# Altium project MAX96724_EVB_revB.PrjPcb
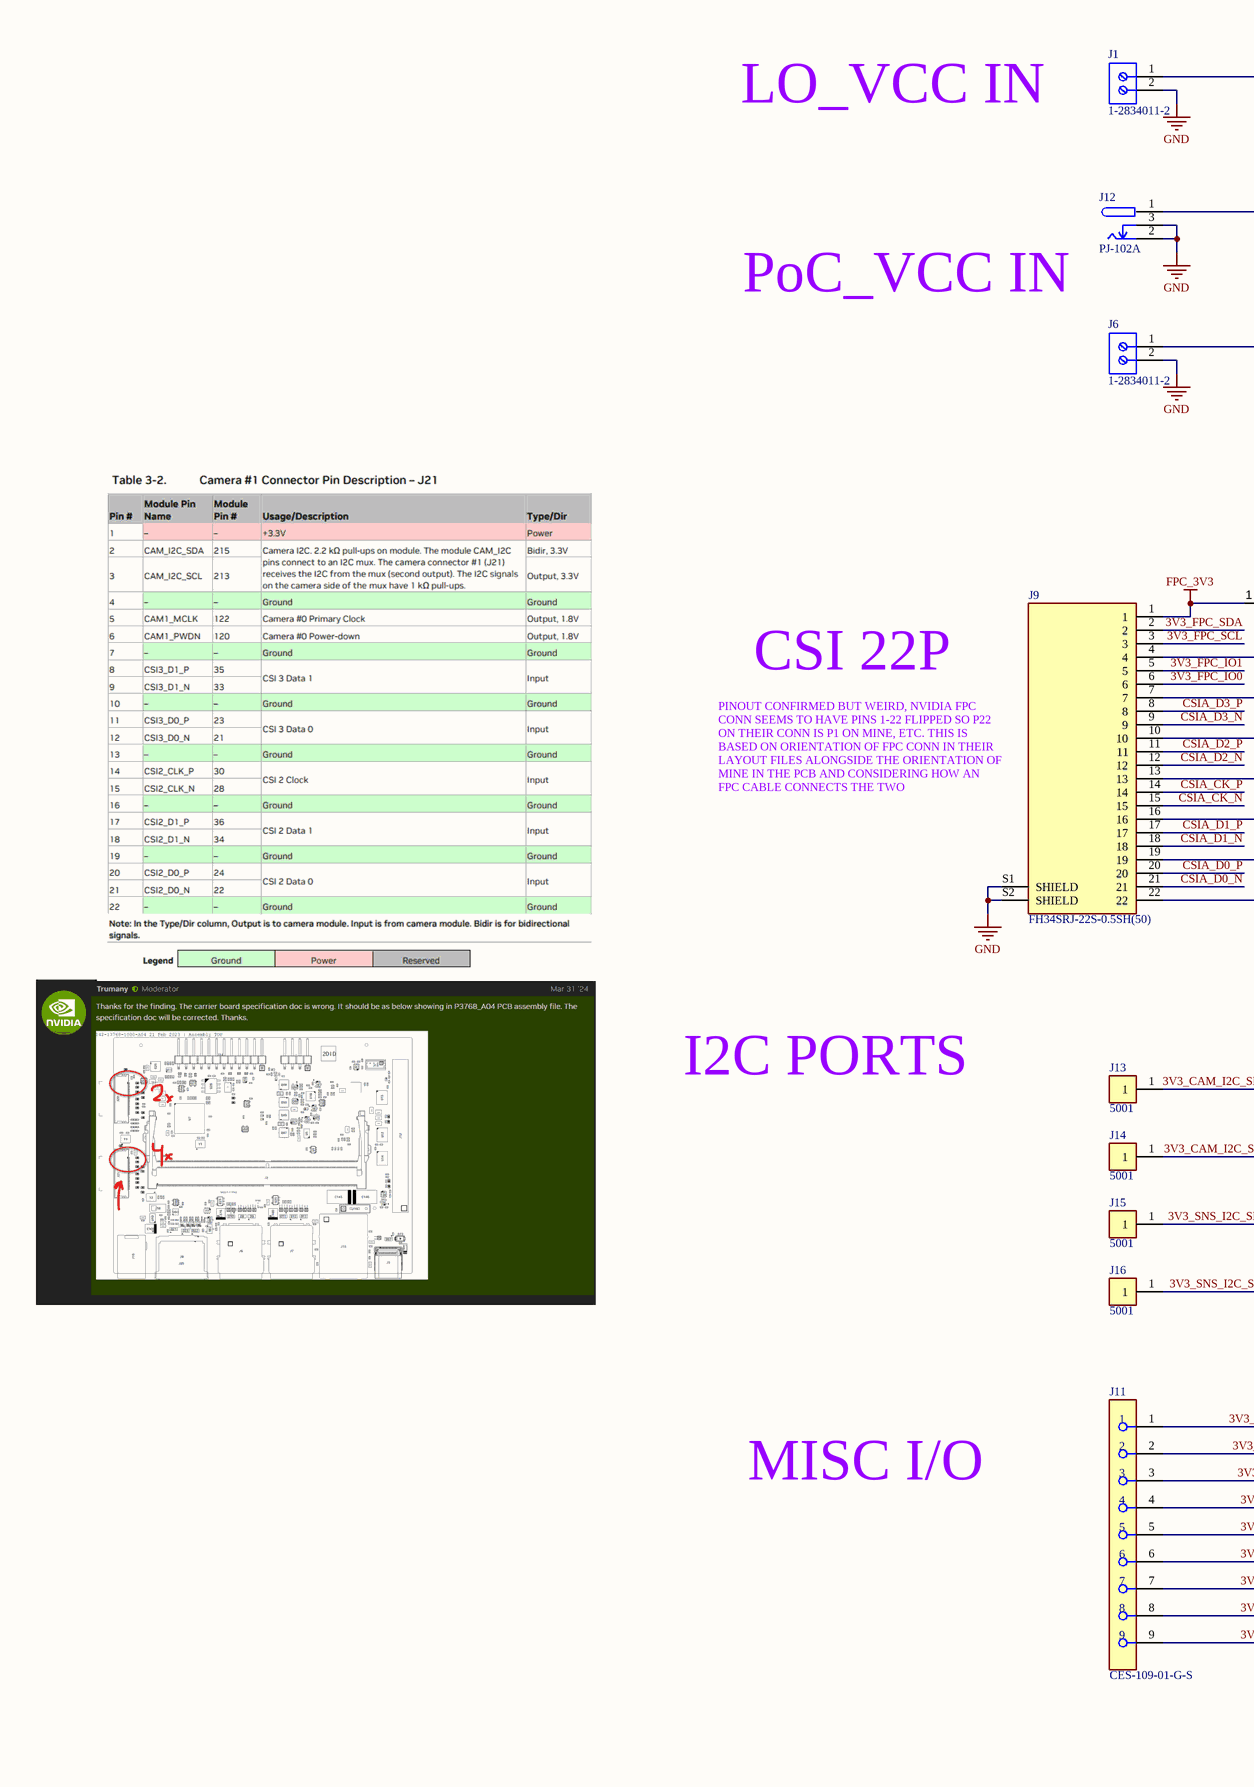
[diagram p0: MAX96724_EVB_revB.SchDoc, left]
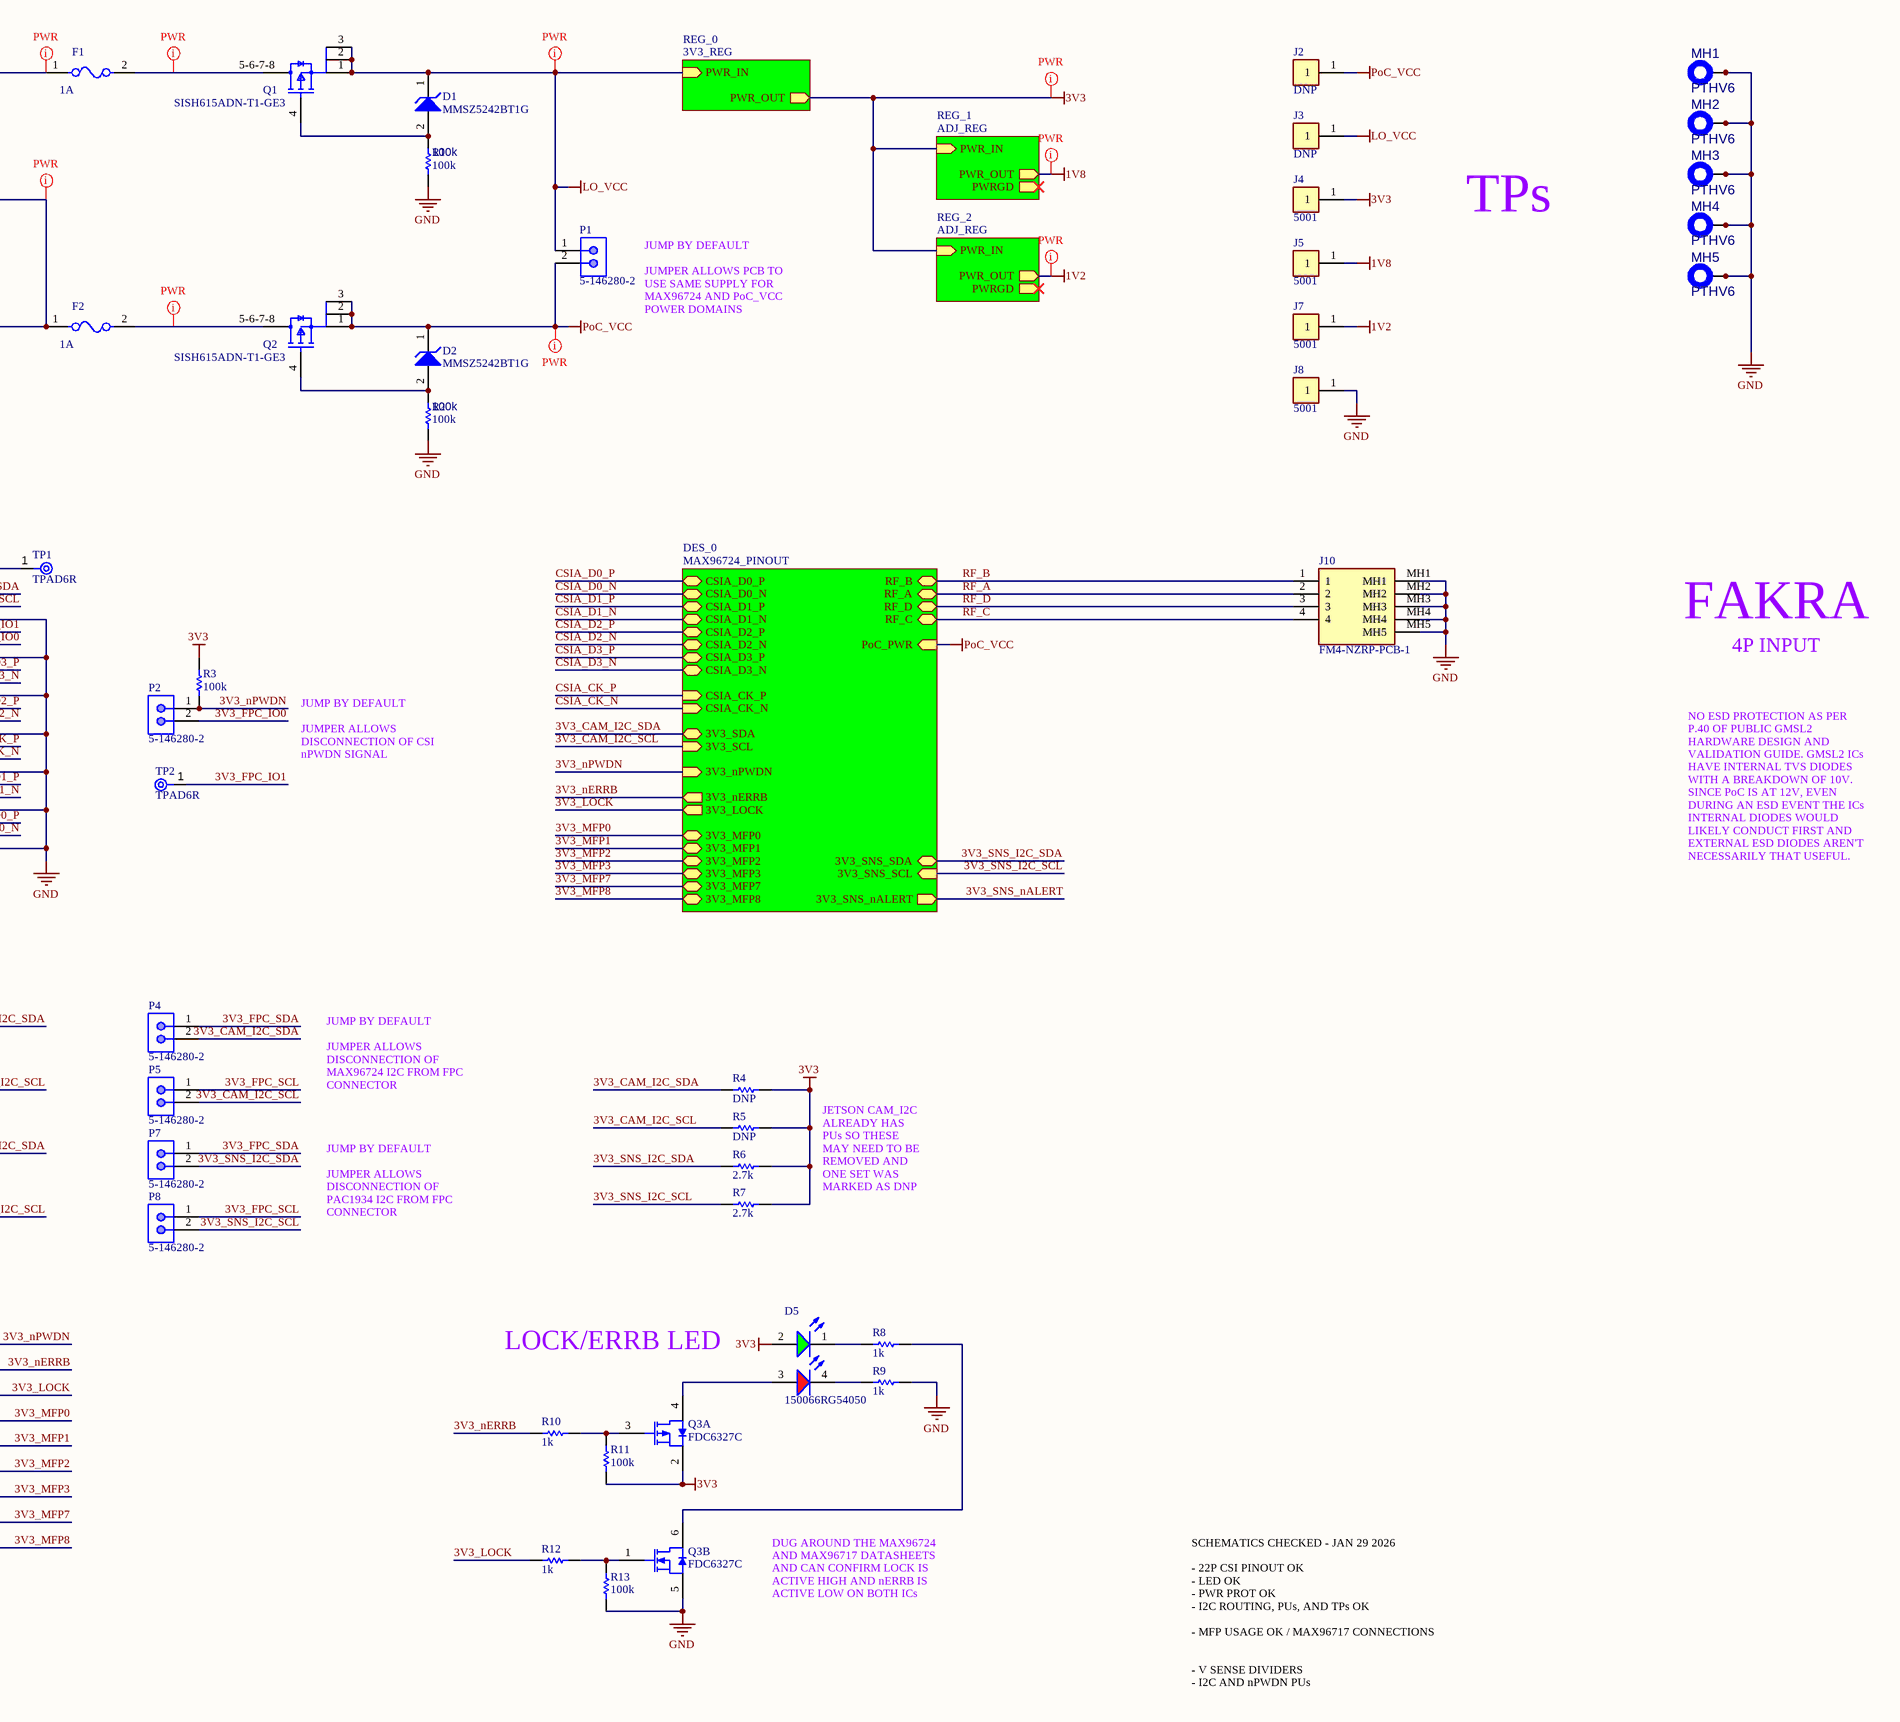
[diagram p1: MAX96724_EVB_revB.SchDoc, right]
4 sheets, 167 parts. Net scope: hierarchical (ports join the sheet entries above them; power ports are global).
Board file: MAX96724_EVB_revB.PcbDoc
Sheets:
  MAX96724_EVB_revB.SchDoc
    DES_0 = MAX96724_PINOUT.SchDoc
    REG_0 = 3V3_REG.SchDoc
    REG_1 = ADJ_REG.SchDoc
    REG_2 = ADJ_REG.SchDoc

## Sheet MAX96724_EVB_revB.SchDoc
size C; SheetNumber: 1; SheetTotal: 4

### Parts
D1  MMSZ5242BT1G  [ONSC-SOD-123-2-425-04_V]
D2  MMSZ5242BT1G  [ONSC-SOD-123-2-425-04_V]
D5  150066RG54050  [WL-SBCD_0606]
F1  1A  [FP-SF-1206FP-MFG]
F2  1A  [FP-SF-1206FP-MFG]
J1  1-2834011-2  [1-2834011-2-Footprint-1]
J2  DNP  [FP-5001-MFG]
J3  DNP  [FP-5001-MFG]
J4  5001  [FP-5001-MFG]
J5  5001  [FP-5001-MFG]
J6  1-2834011-2  [1-2834011-2-Footprint-1]
J7  5001  [FP-5001-MFG]
J8  5001  [FP-5001-MFG]
J9  FH34SRJ-22S-0.5SH(50)  [FH34SRJ-22S-0.5SH(50)-Footprint-1]
J10  FM4-NZRP-PCB-1  [FM4-NZRP-PCB-1-Footprint-1]
J11  CES-109-01-G-S  [FP-CES-109-01-G-S-MFG]
J12  PJ-102A  [FP-PJ-102A-MFG]
J13  5001  [FP-5001-MFG]
J14  5001  [FP-5001-MFG]
J15  5001  [FP-5001-MFG]
J16  5001  [FP-5001-MFG]
MH1  PTHV6  [PTHV6 M2]  (net tie, no BOM)
MH2  PTHV6  [PTHV6 M2]  (net tie, no BOM)
MH3  PTHV6  [PTHV6 M2]  (net tie, no BOM)
MH4  PTHV6  [PTHV6 M2]  (net tie, no BOM)
MH5  PTHV6  [PTHV6 M2]  (net tie, no BOM)
P1  5-146280-2  [TECO-5-146280-2_V]
P2  5-146280-2  [TECO-5-146280-2_V]
P4  5-146280-2  [TECO-5-146280-2_V]
P5  5-146280-2  [TECO-5-146280-2_V]
P7  5-146280-2  [TECO-5-146280-2_V]
P8  5-146280-2  [TECO-5-146280-2_V]
Q1  SISH615ADN-T1-GE3  [SISH615ADN-T1-GE3-Footprint-1]
Q2  SISH615ADN-T1-GE3  [SISH615ADN-T1-GE3-Footprint-1]
Q3  FDC6327C  [FAIR-SOT23-6_V]  (parts A,B of 2)
R1  100k  [R0603B]
R2  100k  [R0603B]
R3  100k  [R0603B]
R4  DNP  [R0603B]
R5  DNP  [R0603B]
R6  2.7k  [R0603B]
R7  2.7k  [R0603B]
R8  1k  [R0603B]
R9  1k  [R0603B]
R10  1k  [R0603B]
R11  100k  [R0603B]
R12  1k  [R0603B]
R13  100k  [R0603B]
TP1  TPAD6R  [New footprint 1]  (no BOM)
TP2  TPAD6R  [New footprint 1]  (no BOM)

### Sub-sheets
DES_0 = MAX96724_PINOUT: PoC_PWR (in), RF_B (bidir), RF_A (bidir), RF_C (bidir), RF_D (bidir), 3V3_SDA (bidir), 3V3_SCL (in), 3V3_nPWDN (in), 3V3_nERRB (out), 3V3_LOCK (out), 3V3_MFP0 (bidir), 3V3_MFP1 (bidir), 3V3_MFP2 (bidir), 3V3_MFP3 (bidir), 3V3_MFP7 (bidir), 3V3_MFP8 (bidir), 3V3_SNS_SDA (bidir), 3V3_SNS_SCL (in), 3V3_SNS_nALERT (out), CSIA_D0_P (bidir), CSIA_D0_N (bidir), CSIA_D1_P (bidir), CSIA_D1_N (bidir), CSIA_D2_P (bidir), CSIA_D2_N (bidir), CSIA_D3_P (bidir), CSIA_D3_N (bidir), CSIA_CK_P (in), CSIA_CK_N (in)
REG_0 = 3V3_REG: PWR_IN (in), PWR_OUT (out)
REG_1 = ADJ_REG: PWR_OUT (out), PWR_IN (in), PWRGD (out)
REG_2 = ADJ_REG: PWR_OUT (out), PWR_IN (in), PWRGD (out)

### Nets
1V2: J7.1 ; sheet REG_2/PWR_OUT
1V8: J5.1 ; sheet REG_1/PWR_OUT
3V3: D5.2(A) J4.1 Q3.2(S) R3.2 R4.2 R5.2 R6.2 R7.2 R11.1 ; sheet REG_0/PWR_OUT, sheet REG_1/PWR_IN, sheet REG_2/PWR_IN
FPC_3V3: J9.1 TP1.1(TP)
GND: J1.2 J6.2 J8.1 J9.4 J9.7 J9.10 J9.13 J9.16 J9.19 J9.22 J9.S1(SHIELD) J9.S2(SHIELD) J10.MH1 J10.MH2 J10.MH3 J10.MH4 J10.MH5 J12.2 J12.3 MH1.1(MH) MH1.2(V1) MH1.3(V2) MH1.4(V3) MH1.5(V4) MH1.6(V5) MH1.7(V6) MH2.1(MH) MH2.2(V1) MH2.3(V2) MH2.4(V3) MH2.5(V4) MH2.6(V5) MH2.7(V6) MH3.1(MH) MH3.2(V1) MH3.3(V2) MH3.4(V3) MH3.5(V4) MH3.6(V5) MH3.7(V6) MH4.1(MH) MH4.2(V1) MH4.3(V2) MH4.4(V3) MH4.5(V4) MH4.6(V5) MH4.7(V6) MH5.1(MH) MH5.2(V1) MH5.3(V2) MH5.4(V3) MH5.5(V4) MH5.6(V5) MH5.7(V6) Q3.5(S) R1.1 R2.1 R9.1 R13.2
LO_VCC: D1.1(K) J3.1 P1.1 Q1.1(S) Q1.2(S) Q1.3(S) ; sheet REG_0/PWR_IN
PoC_VCC: D2.1(K) J2.1 P1.2 Q2.1(S) Q2.2(S) Q2.3(S) ; sheet DES_0/PoC_PWR
3V3_CAM_I2C_SCL: J14.1 P5.2 R5.1 ; sheet DES_0/3V3_SCL
3V3_CAM_I2C_SDA: J13.1 P4.2 R4.1 ; sheet DES_0/3V3_SDA
3V3_FPC_IO0: J9.6 P2.2
3V3_FPC_IO1: J9.5 TP2.1(TP)
3V3_FPC_SCL: J9.3 P5.1 P8.1
3V3_FPC_SDA: J9.2 P4.1 P7.1
3V3_LOCK: J11.3 R12.2 ; sheet DES_0/3V3_LOCK
3V3_MFP0: J11.4 ; sheet DES_0/3V3_MFP0
3V3_MFP1: J11.5 ; sheet DES_0/3V3_MFP1
3V3_MFP2: J11.6 ; sheet DES_0/3V3_MFP2
3V3_MFP3: J11.7 ; sheet DES_0/3V3_MFP3
3V3_MFP7: J11.8 ; sheet DES_0/3V3_MFP7
3V3_MFP8: J11.9 ; sheet DES_0/3V3_MFP8
3V3_nERRB: J11.2 R10.1 ; sheet DES_0/3V3_nERRB
3V3_nPWDN: J11.1 P2.1 R3.1 ; sheet DES_0/3V3_nPWDN
3V3_SNS_I2C_SCL: J16.1 P8.2 R7.1 ; sheet DES_0/3V3_SNS_SCL
3V3_SNS_I2C_SDA: J15.1 P7.2 R6.1 ; sheet DES_0/3V3_SNS_SDA
CSIA_CK_N: J9.15 ; sheet DES_0/CSIA_CK_N
CSIA_CK_P: J9.14 ; sheet DES_0/CSIA_CK_P
CSIA_D0_N: J9.21 ; sheet DES_0/CSIA_D0_N
CSIA_D0_P: J9.20 ; sheet DES_0/CSIA_D0_P
CSIA_D1_N: J9.18 ; sheet DES_0/CSIA_D1_N
CSIA_D1_P: J9.17 ; sheet DES_0/CSIA_D1_P
CSIA_D2_N: J9.12 ; sheet DES_0/CSIA_D2_N
CSIA_D2_P: J9.11 ; sheet DES_0/CSIA_D2_P
CSIA_D3_N: J9.9 ; sheet DES_0/CSIA_D3_N
CSIA_D3_P: J9.8 ; sheet DES_0/CSIA_D3_P
RF_A: J10.2 ; sheet DES_0/RF_A
RF_B: J10.1 ; sheet DES_0/RF_B
RF_C: J10.4 ; sheet DES_0/RF_C
RF_D: J10.3 ; sheet DES_0/RF_D
NetD1_2: D1.2(A) Q1.4(G) R1.2
NetD2_2: D2.2(A) Q2.4(G) R2.2
NetD5_1: D5.1(K) R8.2
NetD5_3: D5.3(A) Q3.4(D)
NetD5_4: D5.4(K) R9.2
NetF1_1: F1.1 J1.1
NetF1_2: F1.2 Q1.5-6-7-8(D)
NetF2_1: F2.1 J6.1 J12.1
NetF2_2: F2.2 Q2.5-6-7-8(D)
NetQ3_1: Q3.1(G) R12.1 R13.1
NetQ3_3: Q3.3(G) R10.2 R11.2
NetQ3_6: Q3.6(D) R8.1

### Layout directives
net class PWR: 1V2, 1V8, 3V3, LO_VCC, NetF1_1, NetF1_2, NetF2_1, NetF2_2, PoC_VCC

### Notes on the sheet
- LO_VCC IN
- TPs
- PoC_VCC IN
- JUMP BY DEFAULT
  JUMPER ALLOWS PCB TO USE SAME SUPPLY FOR MAX96724 AND PoC_VCC POWER DOMAINS
- CSI 22P
- FAKRA
- 4P INPUT
- (near J9) PINOUT CONFIRMED BUT WEIRD, NVIDIA FPC CONN SEEMS TO HAVE PINS 1-22 FLIPPED SO P22 ON THEIR CONN IS P1 ON MINE, ETC. THIS IS BASED ON ORIENTATION OF FPC CONN IN THEIR LAYOUT FILES ALONGSIDE THE ORIENTATION OF MINE IN THE PCB AND CONSIDERING HOW AN FPC CABLE CONNECTS THE TWO
- JUMP BY DEFAULT
  JUMPER ALLOWS DISCONNECTION OF CSI nPWDN SIGNAL
- NO ESD PROTECTION AS PER P.40 OF PUBLIC GMSL2 HARDWARE DESIGN AND VALIDATION GUIDE. GMSL2 ICs HAVE INTERNAL TVS DIODES WITH A BREAKDOWN OF 10V. SINCE PoC IS AT 12V, EVEN DURING AN ESD EVENT THE ICs INTERNAL DIODES WOULD LIKELY CONDUCT FIRST AND EXTERNAL ESD DIODES AREN'T NECESSARILY THAT USEFUL.
- I2C PORTS
- JUMP BY DEFAULT
  JUMPER ALLOWS DISCONNECTION OF MAX96724 I2C FROM FPC CONNECTOR
- JUMP BY DEFAULT
  JUMPER ALLOWS DISCONNECTION OF PAC1934 I2C FROM FPC CONNECTOR
- JETSON CAM_I2C ALREADY HAS PUs SO THESE MAY NEED TO BE REMOVED AND ONE SET WAS MARKED AS DNP
- LOCK/ERRB LED
- MISC I/O
- DUG AROUND THE MAX96724 AND MAX96717 DATASHEETS AND CAN CONFIRM LOCK IS ACTIVE HIGH AND nERRB IS ACTIVE LOW ON BOTH ICs
- SCHEMATICS CHECKED - JAN 29 2026
  - 22P CSI PINOUT OK
  - LED OK
  - PWR PROT OK
  - I2C ROUTING, PUs, AND TPs OK
  - MFP USAGE OK / MAX96717 CONNECTIONS
  - V SENSE DIVIDERS
  - I2C AND nPWDN PUs

### Library data of the parts
D1 D2 = CMP-1060-00565-1: Zener Voltage Regulator, 500 mW, 2-Pin SOD-123, Pb-Free, Tape and Reel; Manufacturer: On Semiconductor; P Max (W): 0.5; VZ Typ (V): 12; PartNumber: MMSZ5242BT1G; PackageReference: SOD-123-2-425-04; ComponentLink3URL: http://www.onsemi.com/pub_link/Collateral/425-04.PDF; Mounting Technology: Surface Mount; ComponentLink2Description: Datasheet; ComponentLink1URL: http://www.onsemi.com/; ComponentLink3Description: Package Specification; PackageDescription: 2-Pin SOD, Body 1.6 x 2.69 mm; PackageVersion: Rev. G, 10/2009; ComponentLink1Description: Manufacturer URL; RoHS: Pb-Free; ComponentLink2URL: http://www.onsemi.com/pub_link/Collateral/MMSZ5221BT1-D.PDF; Packing: Tape and Reel; DatasheetVersion: Rev. 12
D5 = CMP-004-00040-2: Led, Red/Grn, 180Mcd/230Mcd, 624Nm/525Nm Rohs Compliant: Yes; Source: rgled.SchLib; Component Type: Standard; Design Item ID: CMP-004-00034-2; Pins: 4
F1 F2 = CMP-07399-000013-1: FUSE BOARD MOUNT 2A 63VDC 1206; Voltage Rating (DC): 63V; Fuse Type: Board Mount (Cartridge Style Excluded); Approvals: UL; Mount: Surface Mount; Min Operating Temperature: -20°C; Max Operating Temperature: 105°C; Case Code (Imperial): 1206; Packaging: Cut Tape; Current Rating: 2A; RoHS Compliant: Yes; Series: SinglFuse™ SF-1206FP; Case Code (Metric): 3216; Case/Package: 1206
J1 J6 = CMP-002-00067-1: Barrier Strip Terminal Block; RoHS Compliant: Yes
J2-J5 J7 J8 J13-J16 = CMP-2000-05181-2: PC TEST POINT MINIATURE BLACK; Body Material: Bronze; Plating: Silver; Inside Diameter: 1.27mm; Hole Diameter: 1.6mm; Number of Ports: 1; Outside Diameter: 2.54mm; Insulation: Insulated; Insulation Material: Nylon; Mount: Through Hole; RoHS Compliant: Yes; Series: THM; Height: 0.3inch; Termination: Through Hole; Material: Nylon; Packaging: Bulk; Contact Material: Bronze; REACH SVHC: No SVHC; Contact Plating: Silver; Orientation: Straight; Lead Free: Lead Free; Package Quantity: 100; Length: 7.62mm; Flammability Rating: UL94 V-0; Number of Contacts: 1; Diameter: 2.54mm; Housing Color: Black; Color: Black
J9 = CMP-002-00104-1: 0.5Mm Pitch, 1.0Mm Height, Top And Bottom Contact, Back-Flip; Connector Type: Receptacle; Pins: 22; Min Operating Temperature: -55°C; Max Operating Temperature: 105°C; Mounting Technology: Surface Mount
J10 = CMP-002-00044-4: Connector RF Mini-FAKRA Plug 9GHz 50Ohm Solder Right Angle Through Hole; Source: fakra4ch.SchLib; Component Type: Standard; Pins: 9; Design Item ID: CMP-002-00085-1
J11 = CMP-00575-09340057-1: CES-109-01-G-S Conn Socket Strip SKT 9 POS 2.54mm Solder ST Top Entry Thru-Hole Tube; Manufacturer Lifecycle Status: PRODUCTION; Current Rating: 5.5A; Max Current Rating: 1A; Number of Contacts: 9; Max Voltage Rating (AC): 333V; Voltage Rating: 400V; Gender: Receptacle; Contact Resistance: 10mΩ; Depth: 3.05mm; NexarPartId: 9340057; Contact Plating: Gold; Termination: Solder; Housing Color: Black; REACH SVHC: No SVHC; Contact Material: Bronze, Gold, Nickel; Min Operating Temperature: -55°C; Radiation Hardening: No; Orientation: Straight; Length: 22.86mm; RoHS: Compliant; Housing Material: Polyester; Lifecycle Status: Production; Max Operating Temperature: 125°C; Pitch: 2.54mm; Height: 5.21mm; Number of Rows: 1
J12 = CMP-12637-106234071-1: PJ-102A 2.0 x 6.5 mm, 2.5 A, Horizontal, Through Hole, Tapered Pins, Dc Power Jack Connector; Voltage Rating (DC): 24V; Number of Contacts: 3; Outside Diameter: 6.5mm; Gender: Male; Shielding: No; Insulation Resistance: 50MΩ; Current Rating: 2.5A; Inside Diameter: 2mm; Number of Conductors: 2; Housing Color: Black; RoHS: Compliant; Diameter: 2.1mm; Mount: Through Hole; Contact Plating: Nickel; NexarPartId: 106234071; Voltage Rating: 24V; Housing Material: Thermoplastic; Max Operating Temperature: 85°C; Color: Black; Contact Material: Copper, Nickel, Tin; Orientation: Horizontal; Packaging: Bulk; Flammability Rating: UL94 V-0; Schedule B: 8536695050, 8536695050; Contact Gender: Male; Lead Free: Lead Free; Termination: Through Hole; Min Operating Temperature: -25°C; Height: 11.2mm; Lifecycle Status: Production
MH1-MH5 = CMP-00028-00001-13: Plated mounting hole with 6 peripheral vias. This is a generic symbol that groups all relevant footprints.
P1 P2 P4 P5 P7 P8 = CMP-2000-07492-1: Male Header, Pitch 2.54 mm, 1 x 2 Position, Height 8.21 mm, Tail Length 3.05 mm, -65 to 105 degC, RoHS, Bulk; Manufacturer: TE Connectivity; Mating Connector Lock: No(Without); Number of Positions: 2; Pitch: 2.54mm; PCB Mounting Orientation: Vertical; Keyed: No; Case\/Package: 100; Mating Post Length: 0.23inch; High Temperature Housing: Yes; Max Current Rating: 5A; PCB Thickness: 0.063inch; PCB Mount Retention: Without; Approvals: CSA; Current Rating: 3A; Radiation Hardening: No; Length: 4.67mm; Contact Mating Length: 0.23inch; Connector Type: Header; Number of Rows: 1; Termination Post Length: 0.12inch; Board Standoff: No(Without); Max Operating Temperature: 105degC; Contact Shape: Square; Selectively Loaded: No(Without); Gasket: No(Without); Number of Contacts: 2; Contact Gender: Male; Mating Alignment: No(Without); Manufacturer URL: http://www.te.com/; Datasheet URL: http://www.te.com/commerce/DocumentDelivery/DDEController?Action=showdoc&DocId=Customer+Drawing%7F146280%7FH1%7Fpdf%7FEnglish%7FENG_CD_146280_H1.pdf%7F5-146280-2; Mount: ThroughHole; Orientation: Straight; Packaging: Carton; Package Reference: 5-146280-2; Package Quantity: 500; Stabilizers: No(Without); Row Spacing: 2.54mm; Contact Material: CopperAlloy; Panel Mount Retention: No(Without); Datasheet Version: Rev. H1, 08/2016; Housing Colour: Black; Colour: Black; Package Description: Male Header, Pitch 2.54 mm, 1 x 2 Position, Height 8.21 mm, Tail Length 3.05 mm; Contact Plating: Matte; Housing Material: Polymer; Contact Protection: No(Without); Min Operating Temperature: -65degC; Mounting Technology: ThroughHole; Flammability Rating: UL94V-0; RoHSCompliant: true; Termination: ThroughHole; Depth: 2.34mm; High Speed Serial Data Connector: No
Q1 Q2 = CMP-013-00018-2: Trans MOSFET P-CH 20V 22.1A 8-Pin PowerPAK 1212 EP T/R; Source: SISH615ADN-T1-GE3.SchLib; Design Item ID: CMP-013-00036-4; Component Type: Standard; Pins: 5
Q3 = CMP-2000-04939-1: Dual N & P-Channel 2.5 V Specified PowerTrench(TM) MOSFET, -55 to 150 degC, 6-Pin SOT-23, RoHS, Tape and Reel; Manufacturer: Fairchild; Typical Rise Time: 9@NChannel; Rad Hard: No; Maximum Drain Source Voltage: 20V; Typical Fall Time: 3@NChannel; Typical Turn-On Delay Time: 5@NChannel; Maximum Continuous Drain Current: 2.7@NChannel; Typical Turn-Off Delay Time: 12@NChannel; RDS-on: 80@4.5V@NChannel; Channel Mode: Enhancement; Maximum Gate Source Voltage: ±8V; Package Version: Rev. 5, 05/2015; Operating Temperature: -55to150degC; Packaging: Tape&Reel; Package Reference: SOT23-6; Package URL: https://www.fairchildsemi.com/package-drawings/MA/MA06A.pdf; Package Description: 6-Pin Small Outline Transistor, Body 2.9 x 1.6 mm, Pitch 0.95 mm; Manufacturer URL: https://www.fairchildsemi.com/; Channel Type: N; Datasheet Version: Rev. E, 07/2000; Package: 6SuperSOT; Datasheet URL: https://www.fairchildsemi.com/datasheets/FD/FDC6327C.pdf; Mounting: SurfaceMount; Category: MOSFET
R1-R13 = CMP-009-00002-14: Resistor
  R1 R2: Value: 100k
TP1 TP2 = CMP-00025-3: Test Point .6mm

## Sheet MAX96724_PINOUT.SchDoc
size D; SheetNumber: 2; SheetTotal: 4
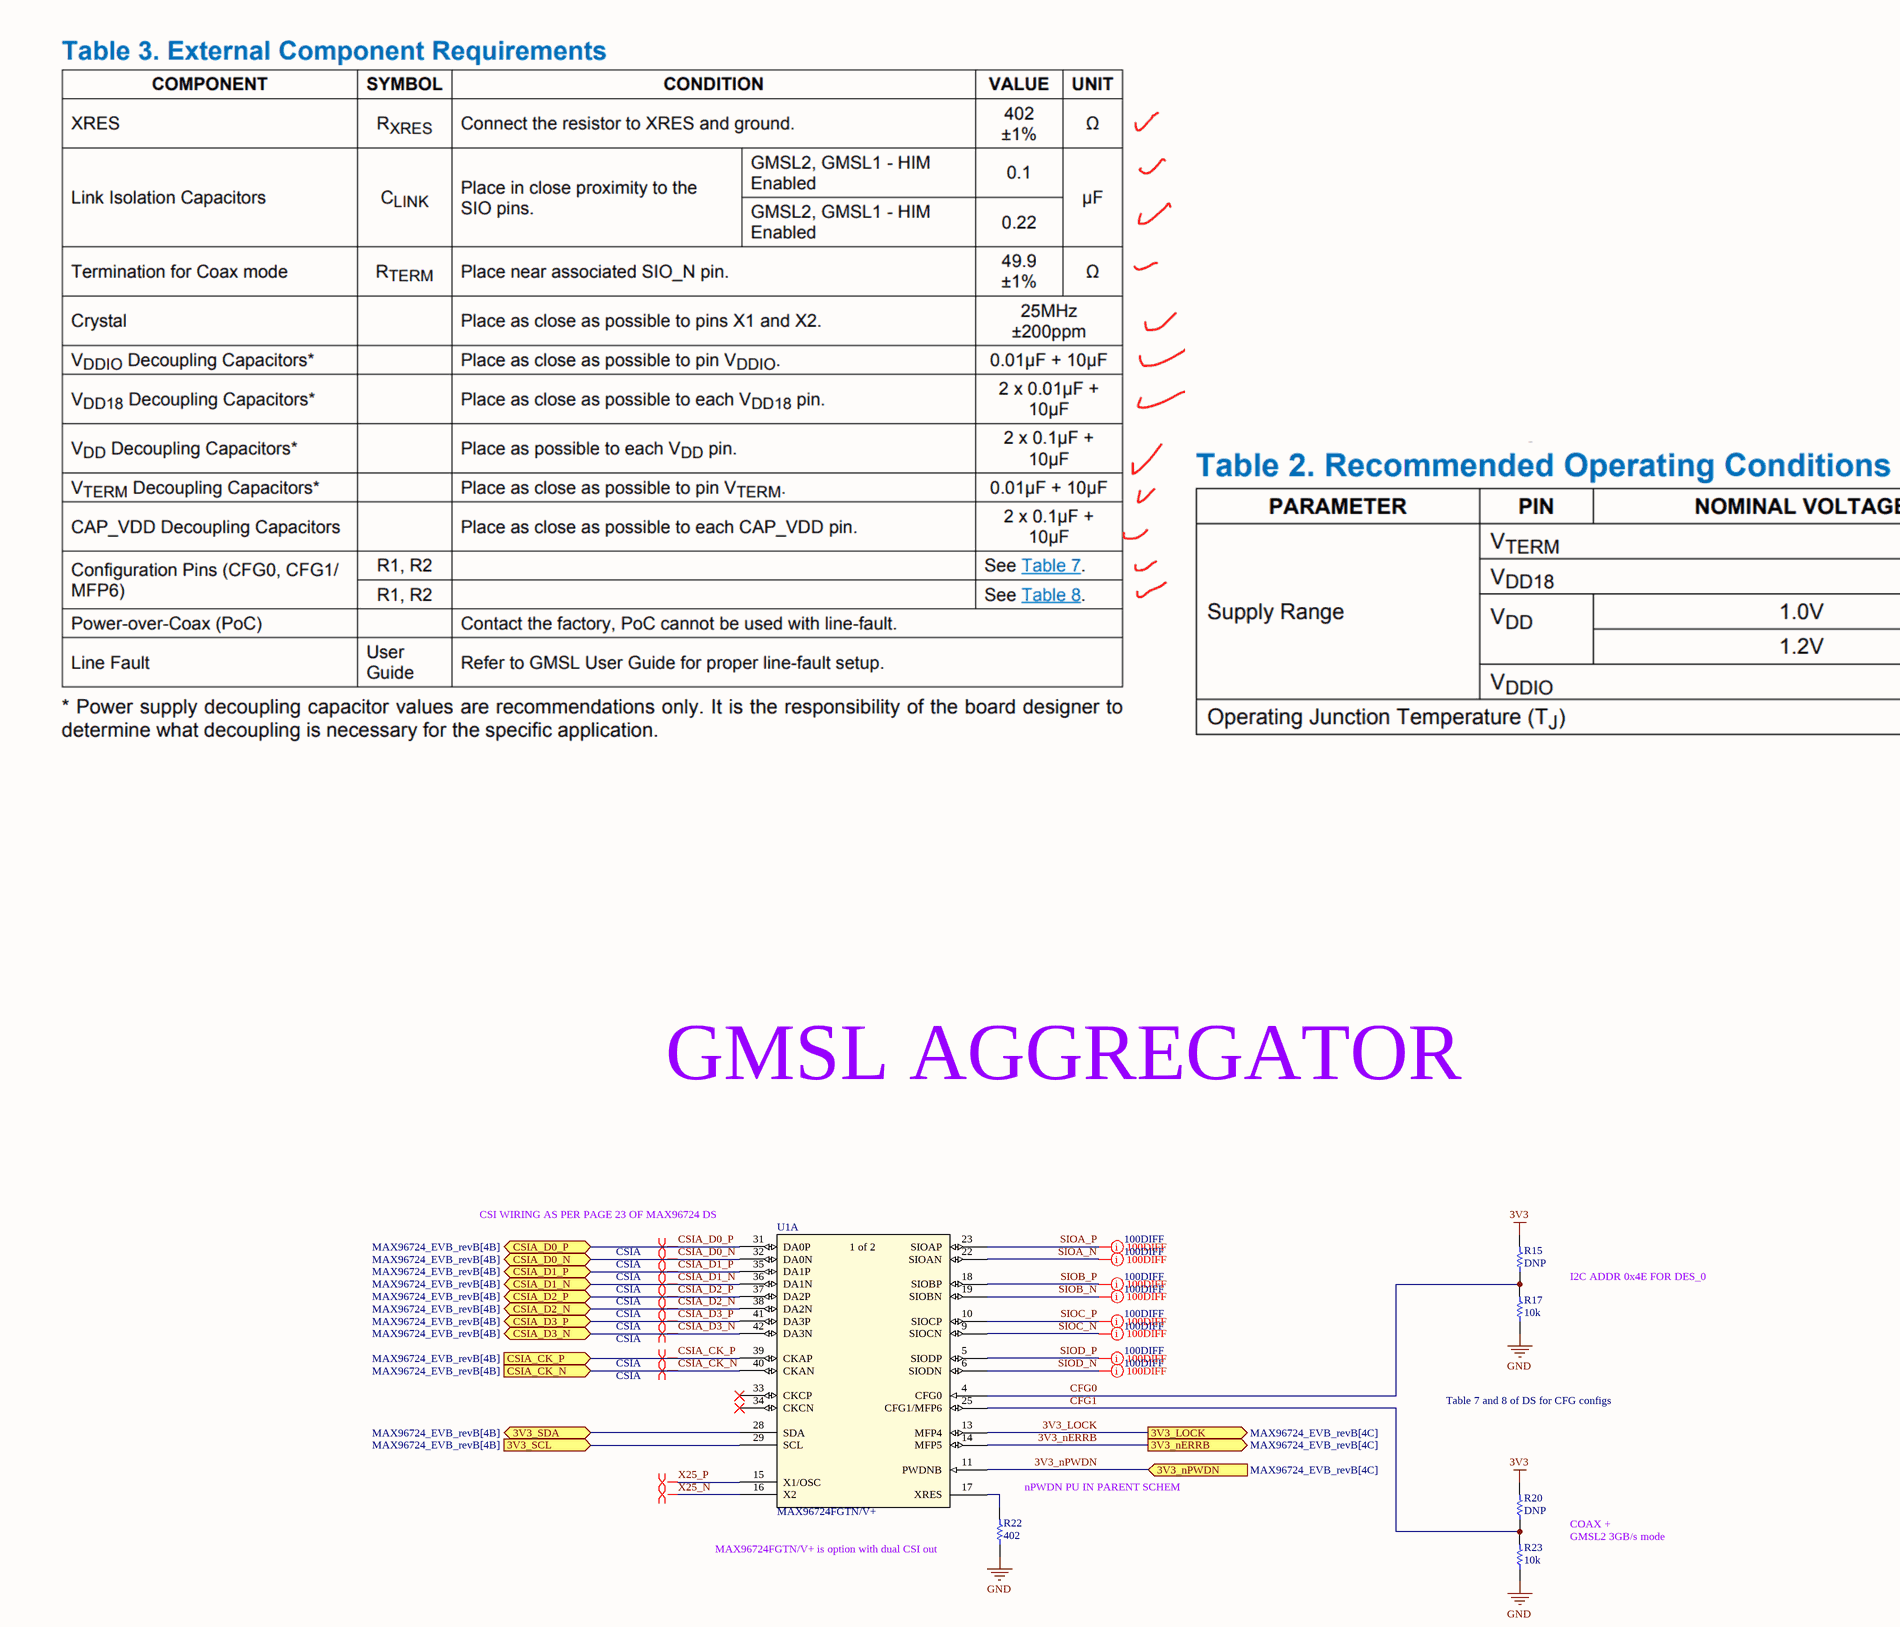
[diagram p2: MAX96724_PINOUT.SchDoc, top left]
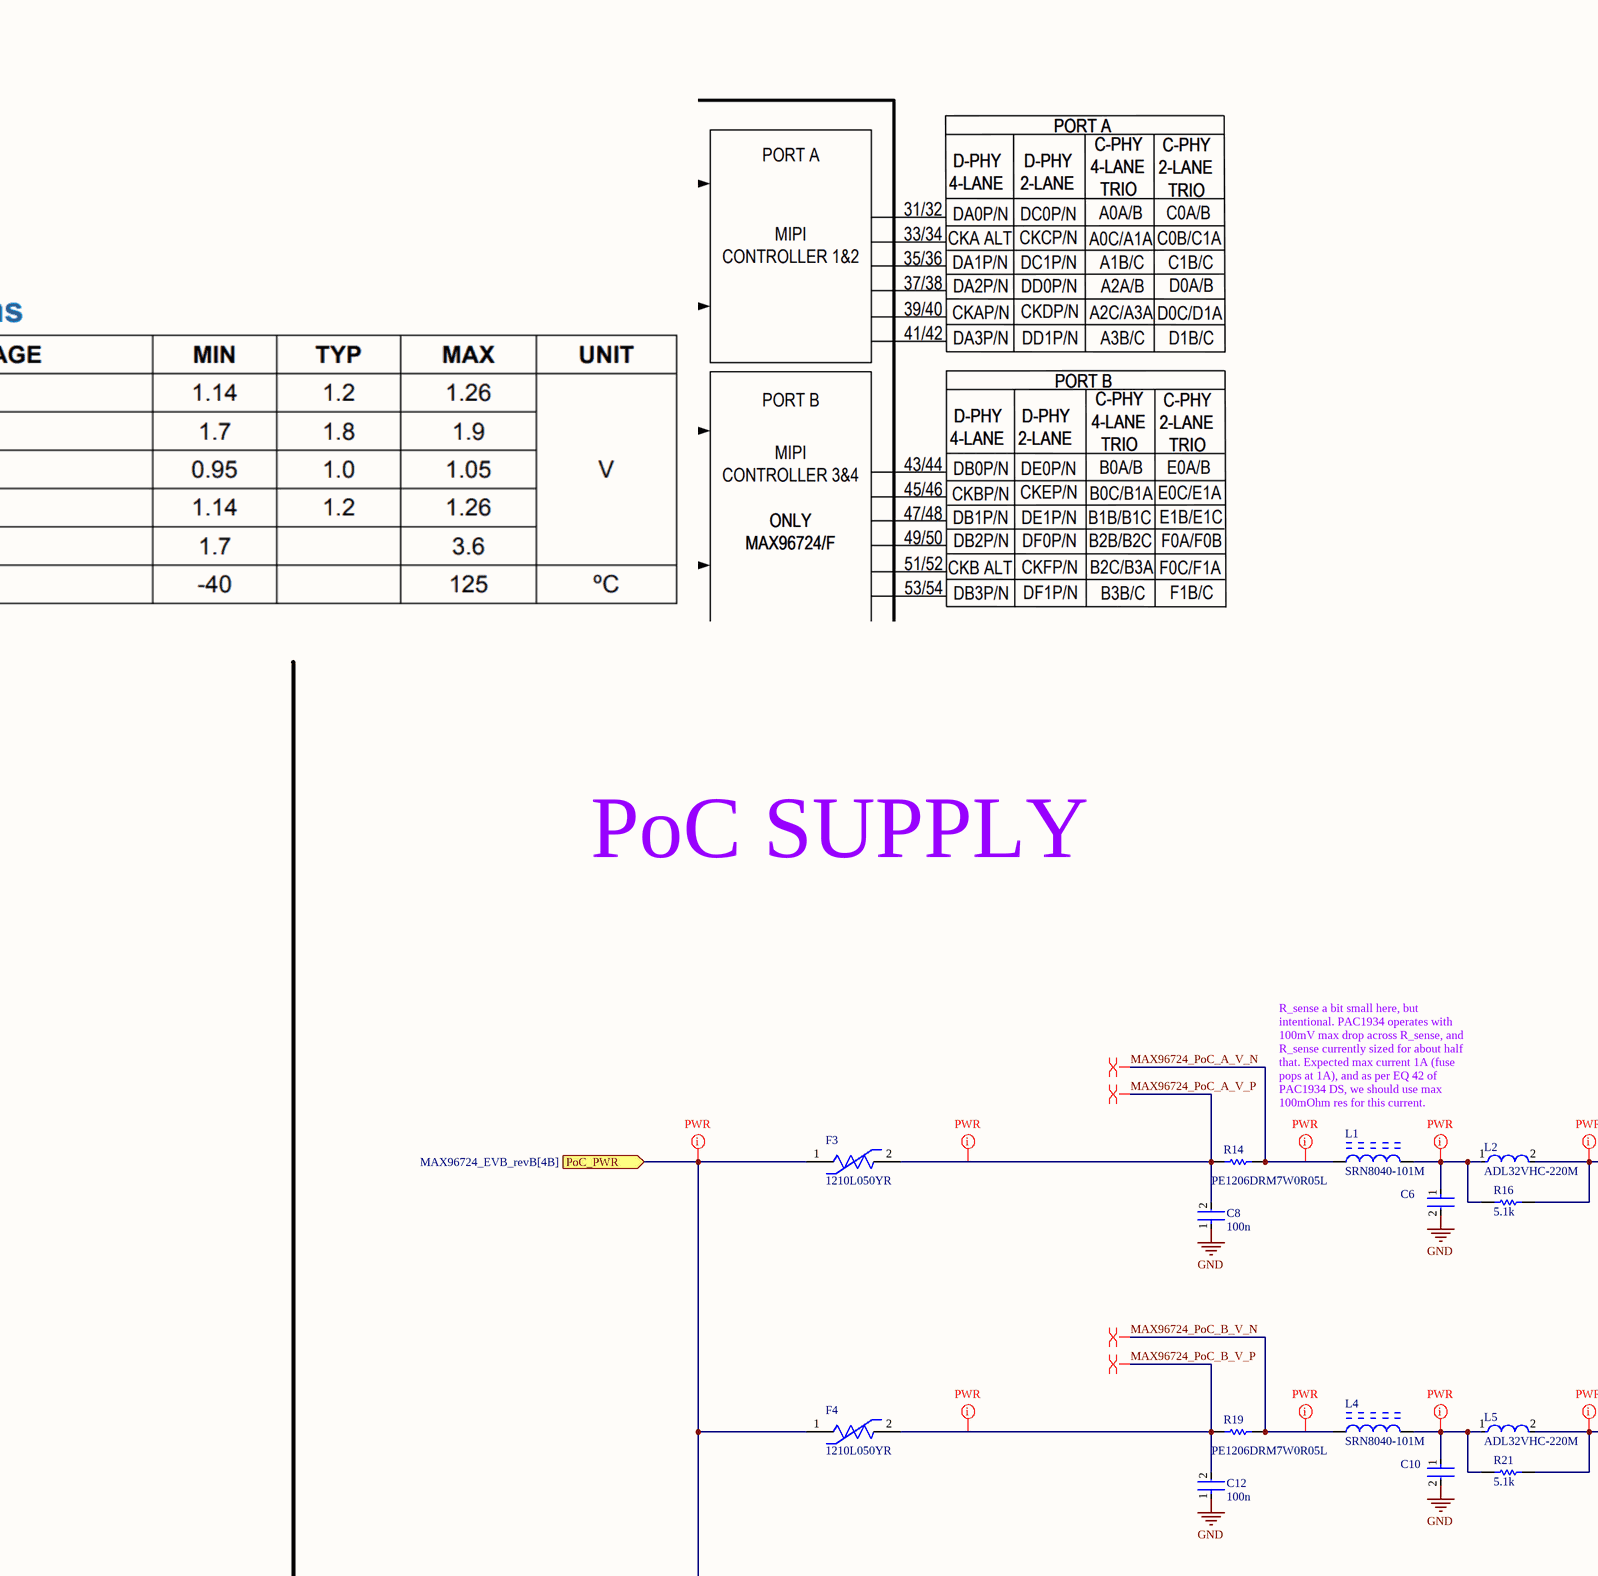
[diagram p3: MAX96724_PINOUT.SchDoc, top middle]
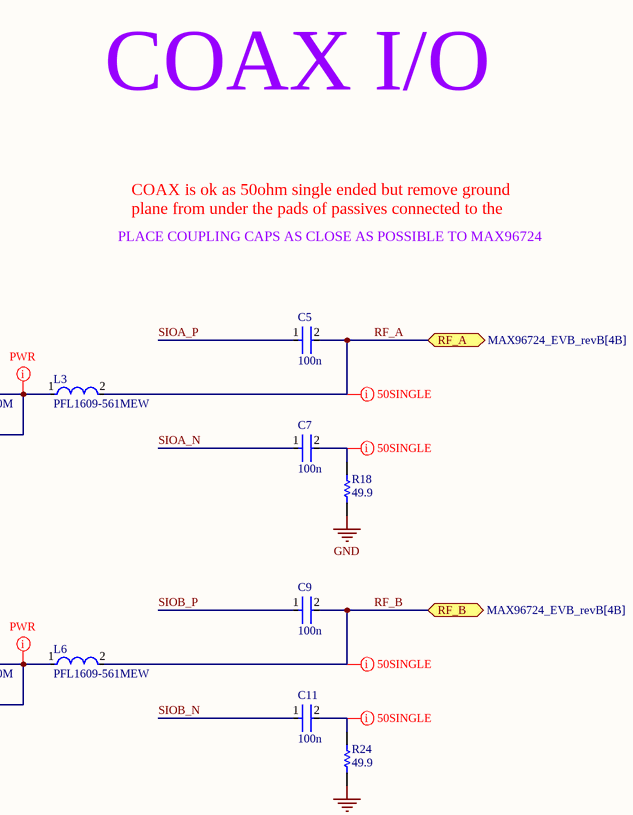
[diagram p4: MAX96724_PINOUT.SchDoc, top right]
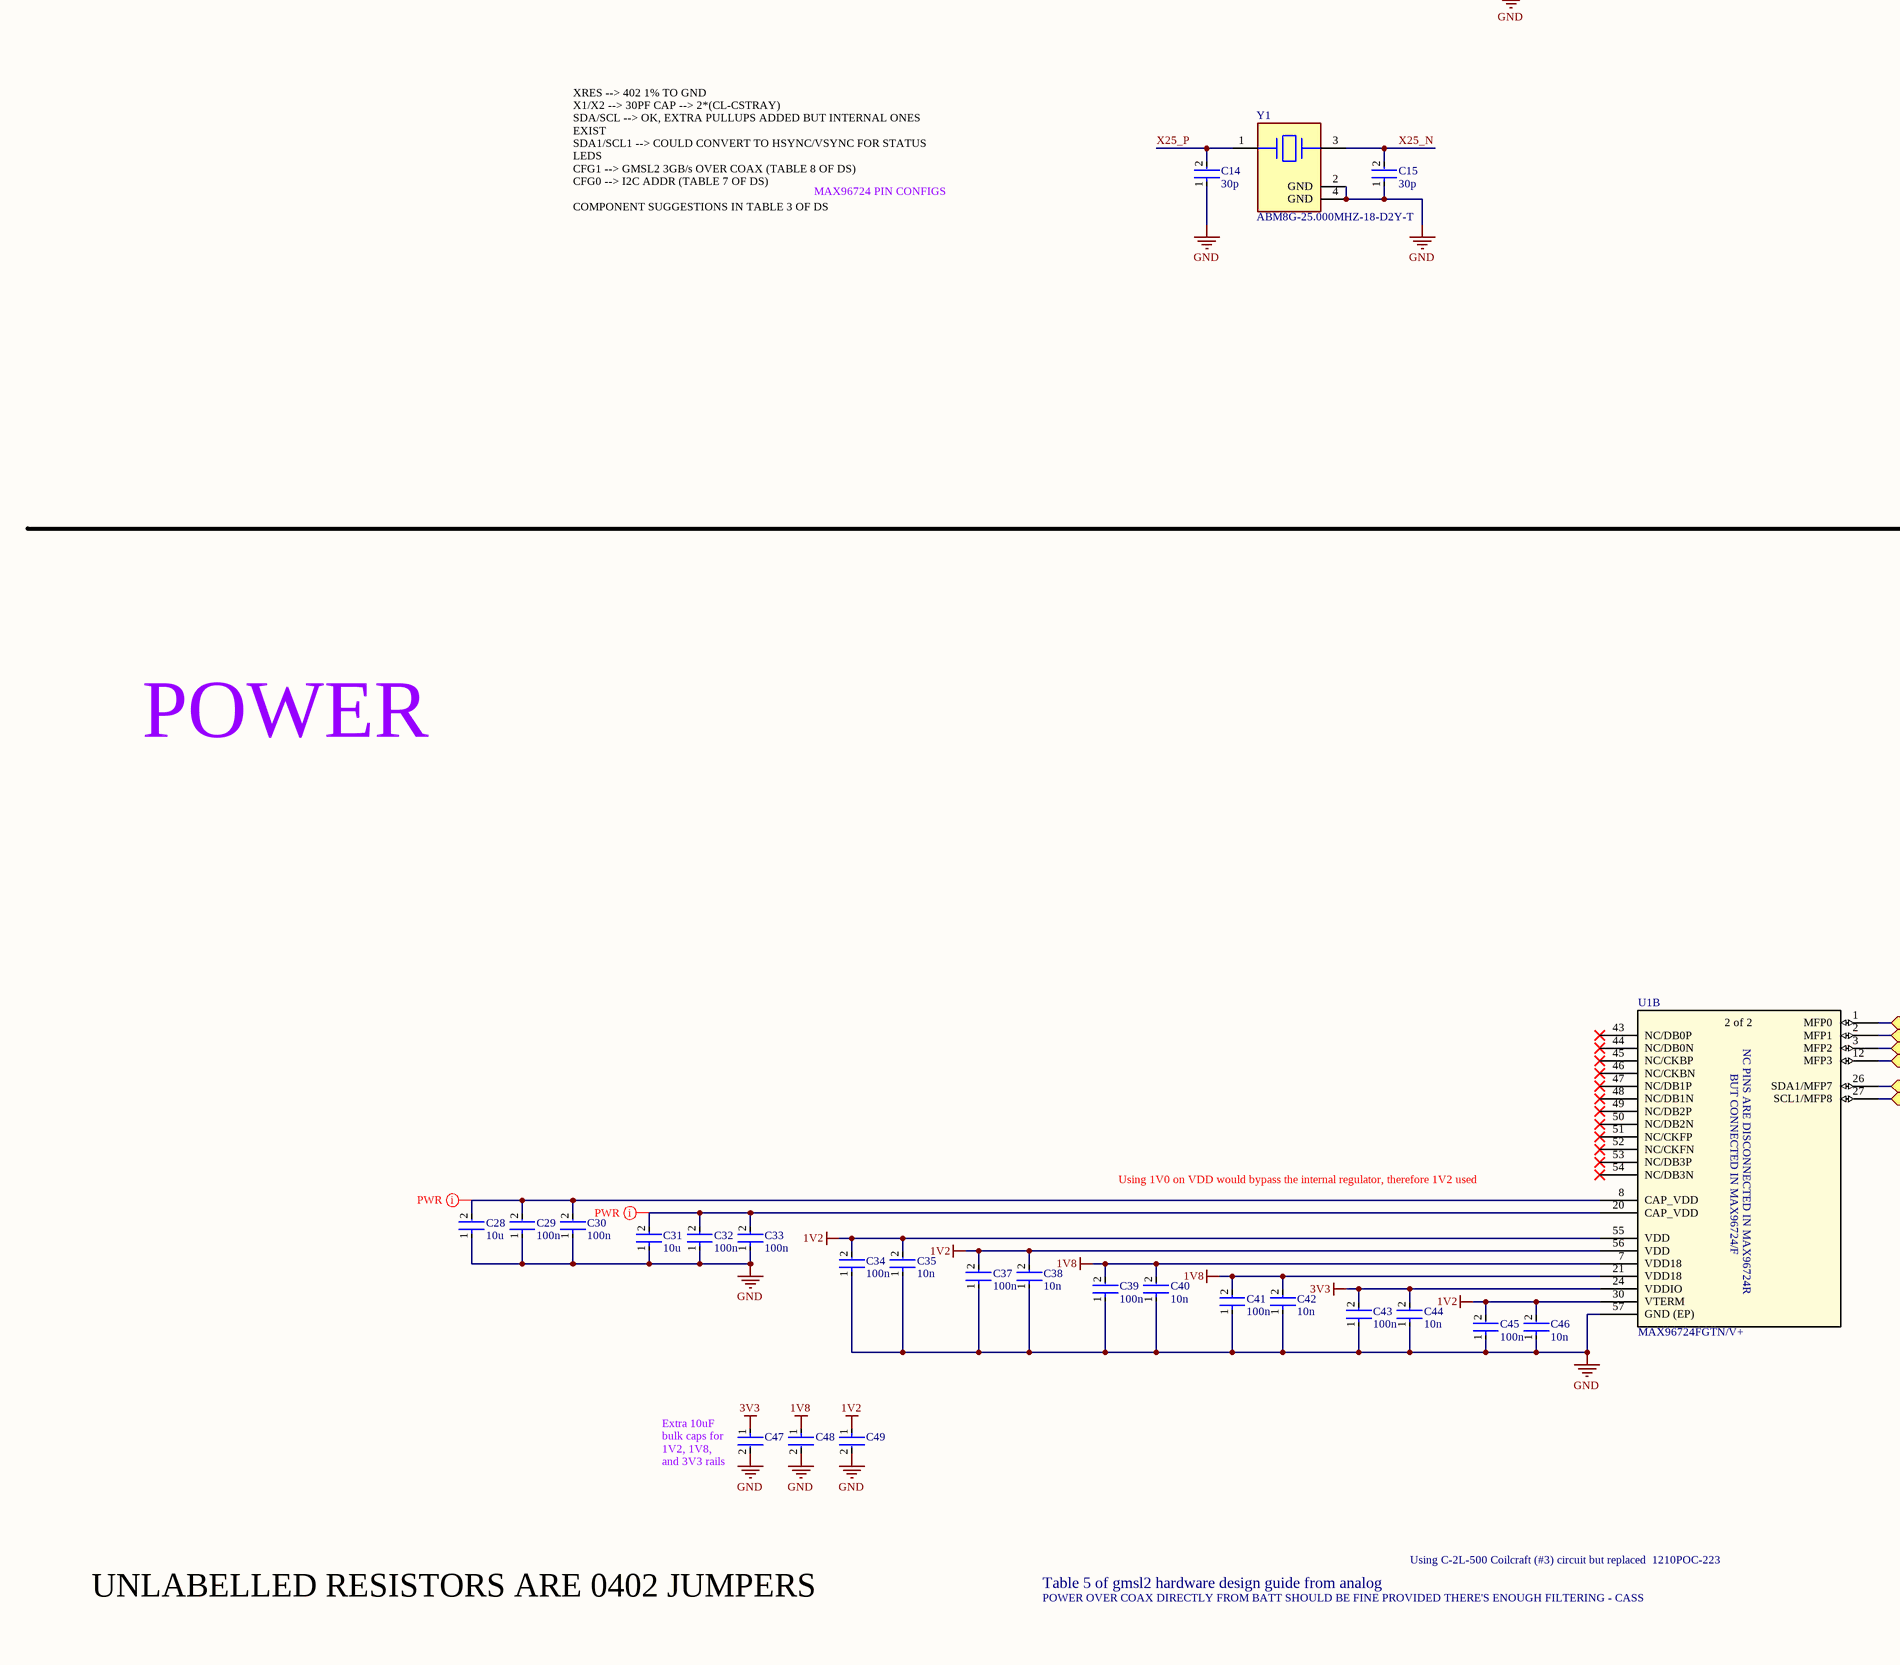
[diagram p5: MAX96724_PINOUT.SchDoc, bottom left]
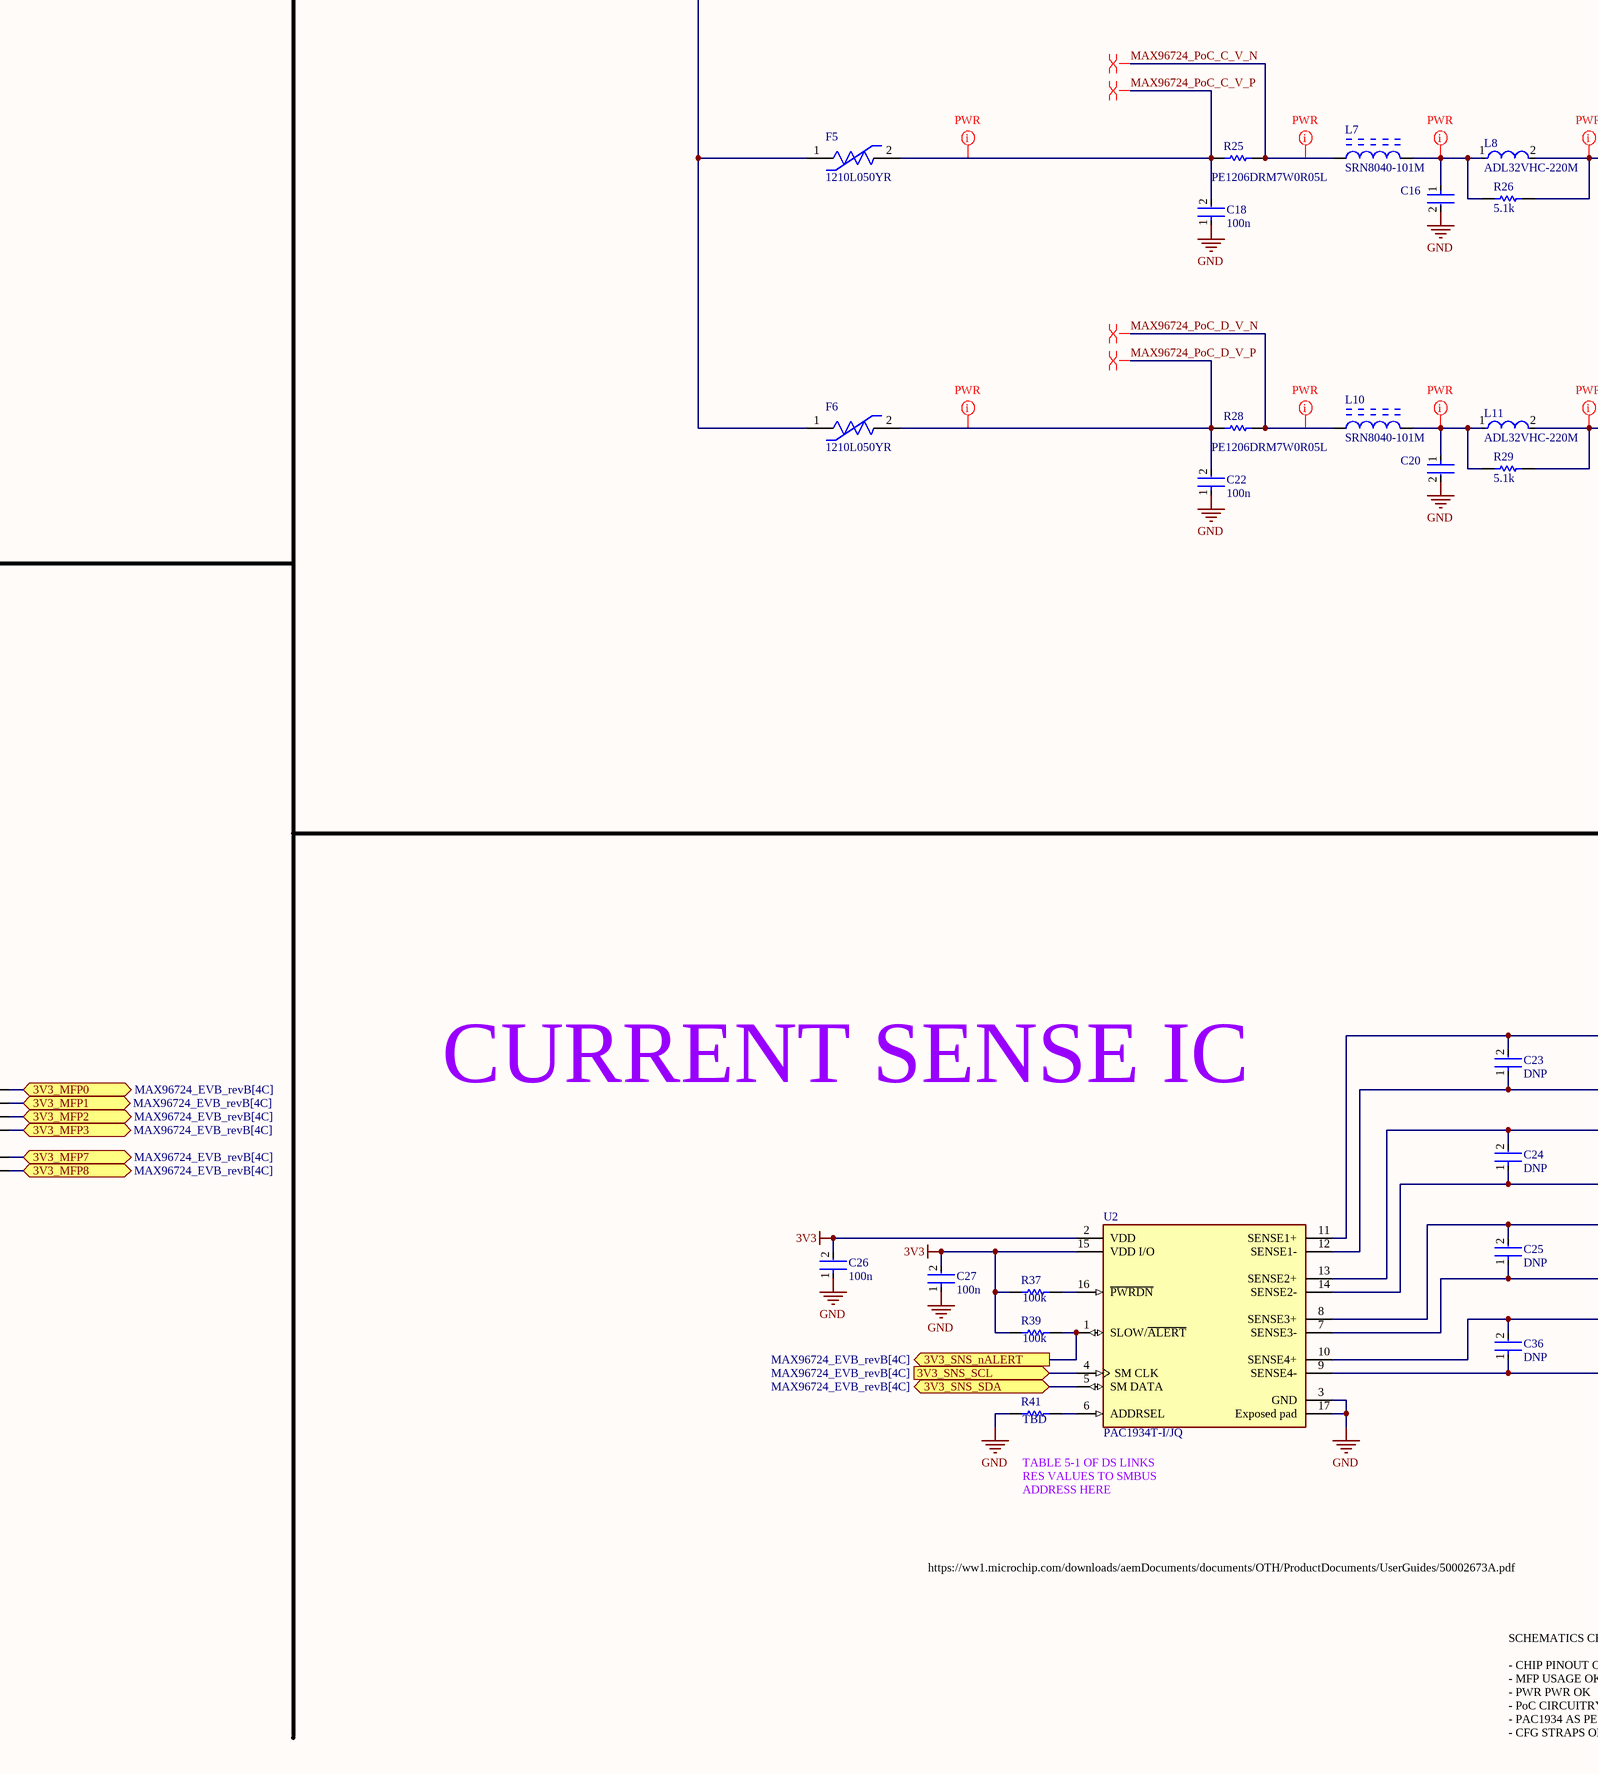
[diagram p6: MAX96724_PINOUT.SchDoc, bottom middle]
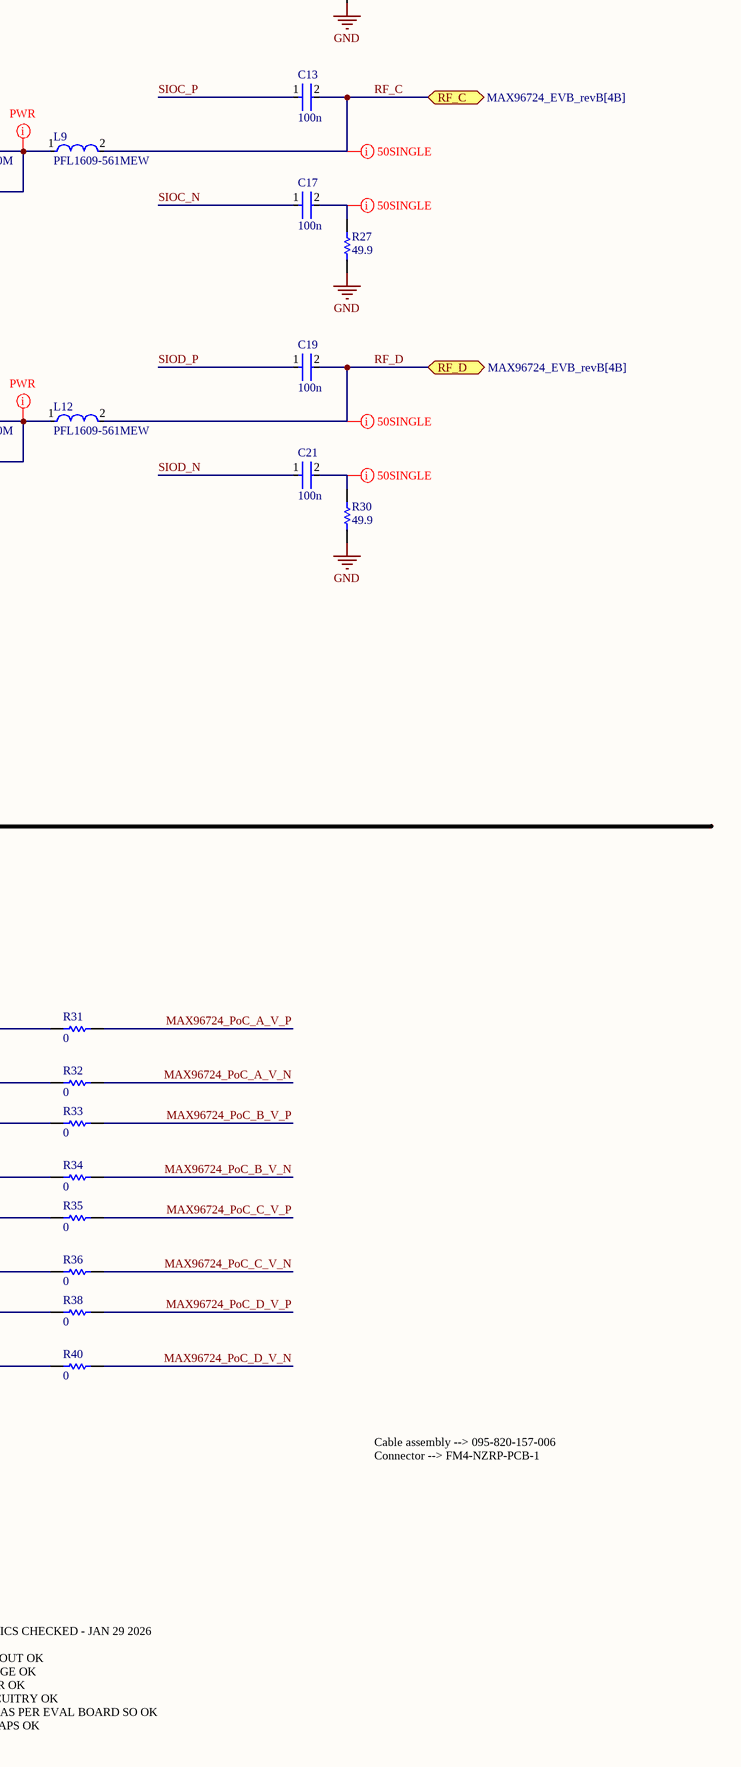
[diagram p7: MAX96724_PINOUT.SchDoc, bottom right]

### Parts
C5  100n  [FP-0402-L_1_0_0_05-W_0_5-IPC_A]
C6  GRM21BR61E226ME44L  [FP-GRM21B-0_2-e0_2_0_7-IPC_B]  (value not drawn)
C7  100n  [FP-0402-L_1_0_0_05-W_0_5-IPC_A]
C8  100n  [FP-0402-L_1_0_0_05-W_0_5-IPC_A]
C9  100n  [FP-0402-L_1_0_0_05-W_0_5-IPC_A]
C10  GRM21BR61E226ME44L  [FP-GRM21B-0_2-e0_2_0_7-IPC_B]  (value not drawn)
C11  100n  [FP-0402-L_1_0_0_05-W_0_5-IPC_A]
C12  100n  [FP-0402-L_1_0_0_05-W_0_5-IPC_A]
C13  100n  [FP-0402-L_1_0_0_05-W_0_5-IPC_A]
C14  30p  [FP-0402-L_1_0_0_05-W_0_5-IPC_A]
C15  30p  [FP-0402-L_1_0_0_05-W_0_5-IPC_A]
C16  GRM21BR61E226ME44L  [FP-GRM21B-0_2-e0_2_0_7-IPC_B]  (value not drawn)
C17  100n  [FP-0402-L_1_0_0_05-W_0_5-IPC_A]
C18  100n  [FP-0402-L_1_0_0_05-W_0_5-IPC_A]
C19  100n  [FP-0402-L_1_0_0_05-W_0_5-IPC_A]
C20  GRM21BR61E226ME44L  [FP-GRM21B-0_2-e0_2_0_7-IPC_B]  (value not drawn)
C21  100n  [FP-0402-L_1_0_0_05-W_0_5-IPC_A]
C22  100n  [FP-0402-L_1_0_0_05-W_0_5-IPC_A]
C23  DNP  [FP-0402-L_1_0_0_05-W_0_5-IPC_A]
C24  DNP  [FP-0402-L_1_0_0_05-W_0_5-IPC_A]
C25  DNP  [FP-0402-L_1_0_0_05-W_0_5-IPC_A]
C26  100n  [FP-0402-L_1_0_0_05-W_0_5-IPC_A]
C27  100n  [FP-0402-L_1_0_0_05-W_0_5-IPC_A]
C28  10u  [FP-0402-L_1_0_0_05-W_0_5-IPC_A]
C29  100n  [FP-0402-L_1_0_0_05-W_0_5-IPC_A]
C30  100n  [FP-0402-L_1_0_0_05-W_0_5-IPC_A]
C31  10u  [FP-0402-L_1_0_0_05-W_0_5-IPC_A]
C32  100n  [FP-0402-L_1_0_0_05-W_0_5-IPC_A]
C33  100n  [FP-0402-L_1_0_0_05-W_0_5-IPC_A]
C34  100n  [FP-0402-L_1_0_0_05-W_0_5-IPC_A]
C35  10n  [FP-0402-L_1_0_0_05-W_0_5-IPC_A]
C36  DNP  [FP-0402-L_1_0_0_05-W_0_5-IPC_A]
C37  100n  [FP-0402-L_1_0_0_05-W_0_5-IPC_A]
C38  10n  [FP-0402-L_1_0_0_05-W_0_5-IPC_A]
C39  100n  [FP-0402-L_1_0_0_05-W_0_5-IPC_A]
C40  10n  [FP-0402-L_1_0_0_05-W_0_5-IPC_A]
C41  100n  [FP-0402-L_1_0_0_05-W_0_5-IPC_A]
C42  10n  [FP-0402-L_1_0_0_05-W_0_5-IPC_A]
C43  100n  [FP-0402-L_1_0_0_05-W_0_5-IPC_A]
C44  10n  [FP-0402-L_1_0_0_05-W_0_5-IPC_A]
C45  100n  [FP-0402-L_1_0_0_05-W_0_5-IPC_A]
C46  10n  [FP-0402-L_1_0_0_05-W_0_5-IPC_A]
C47  EMK107BBJ106MA-T  [FP-0603-L_1_6_0_2-W_0_8_0-MFG]  (value not drawn)
C48  EMK107BBJ106MA-T  [FP-0603-L_1_6_0_2-W_0_8_0-MFG]  (value not drawn)
C49  EMK107BBJ106MA-T  [FP-0603-L_1_6_0_2-W_0_8_0-MFG]  (value not drawn)
F3  1210L050YR  [FP-1210L050YR-MFG]
F4  1210L050YR  [FP-1210L050YR-MFG]
F5  1210L050YR  [FP-1210L050YR-MFG]
F6  1210L050YR  [FP-1210L050YR-MFG]
L1  SRN8040-101M  [BOUR-SRN8040-101M_V]
L2  ADL32VHC-220M  [FP-1210POC-MFG]
L3  PFL1609-561MEW  [FP-PFL1609-MFG]
L4  SRN8040-101M  [BOUR-SRN8040-101M_V]
L5  ADL32VHC-220M  [FP-1210POC-MFG]
L6  PFL1609-561MEW  [FP-PFL1609-MFG]
L7  SRN8040-101M  [BOUR-SRN8040-101M_V]
L8  ADL32VHC-220M  [FP-1210POC-MFG]
L9  PFL1609-561MEW  [FP-PFL1609-MFG]
L10  SRN8040-101M  [BOUR-SRN8040-101M_V]
L11  ADL32VHC-220M  [FP-1210POC-MFG]
L12  PFL1609-561MEW  [FP-PFL1609-MFG]
R14  PE1206DRM7W0R05L  [R1206B]
R15  DNP  [R0603B]
R16  5.1k  [R0603B]
R17  10k  [R0603B]
R18  49.9  [R0603B]
R19  PE1206DRM7W0R05L  [R1206B]
R20  DNP  [R0603B]
R21  5.1k  [R0603B]
R22  402  [R0603B]
R23  10k  [R0603B]
R24  49.9  [R0603B]
R25  PE1206DRM7W0R05L  [R1206B]
R26  5.1k  [R0603B]
R27  49.9  [R0603B]
R28  PE1206DRM7W0R05L  [R1206B]
R29  5.1k  [R0603B]
R30  49.9  [R0603B]
R31  0  [R0603B]
R32  0  [R0603B]
R33  0  [R0603B]
R34  0  [R0603B]
R35  0  [R0603B]
R36  0  [R0603B]
R37  100k  [R0603B]
R38  0  [R0603B]
R39  100k  [R0603B]
R40  0  [R0603B]
R41  TBD  [R0603B]
U1  MAX96724FGTN/V+  [MAX96724FGTN_V+-Footprint-1]  (parts A,B of 2)
U2  PAC1934T-I/JQ  [FP-C04-257-MFG]
Y1  ABM8G-25.000MHZ-18-D2Y-T  [FP-ABM8G-MFG]

### Ports
3V3_LOCK (out, see MAX96724_EVB_revB[4C]), 3V3_MFP0 (bidir, see MAX96724_EVB_revB[4C]), 3V3_MFP1 (bidir, see MAX96724_EVB_revB[4C]), 3V3_MFP2 (bidir, see MAX96724_EVB_revB[4C]), 3V3_MFP3 (bidir, see MAX96724_EVB_revB[4C]), 3V3_MFP7 (bidir, see MAX96724_EVB_revB[4C]), 3V3_MFP8 (bidir, see MAX96724_EVB_revB[4C]), 3V3_nERRB (out, see MAX96724_EVB_revB[4C]), 3V3_nPWDN (in, see MAX96724_EVB_revB[4C]), 3V3_SCL (in, see MAX96724_EVB_revB[4B]), 3V3_SDA (bidir, see MAX96724_EVB_revB[4B]), 3V3_SNS_nALERT (out, see MAX96724_EVB_revB[4C]), 3V3_SNS_SCL (in, see MAX96724_EVB_revB[4C]), 3V3_SNS_SDA (bidir, see MAX96724_EVB_revB[4C]), CSIA_CK_N (in, see MAX96724_EVB_revB[4B]), CSIA_CK_P (in, see MAX96724_EVB_revB[4B]), CSIA_D0_N (bidir, see MAX96724_EVB_revB[4B]), CSIA_D0_P (bidir, see MAX96724_EVB_revB[4B]), CSIA_D1_N (bidir, see MAX96724_EVB_revB[4B]), CSIA_D1_P (bidir, see MAX96724_EVB_revB[4B]), CSIA_D2_N (bidir, see MAX96724_EVB_revB[4B]), CSIA_D2_P (bidir, see MAX96724_EVB_revB[4B]), CSIA_D3_N (bidir, see MAX96724_EVB_revB[4B]), CSIA_D3_P (bidir, see MAX96724_EVB_revB[4B]), PoC_PWR (in, see MAX96724_EVB_revB[4B]), RF_A (bidir, see MAX96724_EVB_revB[4B]), RF_B (bidir, see MAX96724_EVB_revB[4B]), RF_C (bidir, see MAX96724_EVB_revB[4B]), RF_D (bidir, see MAX96724_EVB_revB[4B])

### Nets
1V2: C34.2 C35.2 C37.2 C38.2 C45.2 C46.2 C49.1 U1.30(VTERM) U1.55(VDD) U1.56(VDD)
1V8: C39.2 C40.2 C41.2 C42.2 C48.1 U1.7(VDD18) U1.21(VDD18)
3V3: C26.2 C27.2 C43.2 C44.2 C47.1 R15.2 R20.2 R37.2 R39.2 U1.24(VDDIO) U2.2(VDD) U2.15(VDD_I/O)
GND: C6.2 C8.1 C10.2 C12.1 C14.1 C15.1 C16.2 C18.1 C20.2 C22.1 C26.1 C27.1 C28.1 C29.1 C30.1 C31.1 C32.1 C33.1 C34.1 C35.1 C37.1 C38.1 C39.1 C40.1 C41.1 C42.1 C43.1 C44.1 C45.1 C46.1 C47.2 C48.2 C49.2 R17.1 R18.1 R22.1 R23.1 R24.1 R27.1 R30.1 R41.2 U1.57(GND_(EP)) U2.3(GND) U2.17(Exposed_pad) Y1.2(GND) Y1.4(GND)
PoC_VCC: F3.1 F4.1 F5.1 F6.1 ; port PoC_PWR
3V3_CAM_I2C_SCL: U1.29(SCL) ; port 3V3_SCL
3V3_CAM_I2C_SDA: U1.28(SDA) ; port 3V3_SDA
3V3_LOCK: U1.13(MFP4) ; port 3V3_LOCK
3V3_MFP0: U1.1(MFP0) ; port 3V3_MFP0
3V3_MFP1: U1.2(MFP1) ; port 3V3_MFP1
3V3_MFP2: U1.3(MFP2) ; port 3V3_MFP2
3V3_MFP3: U1.12(MFP3) ; port 3V3_MFP3
3V3_MFP7: U1.26(SDA1/MFP7) ; port 3V3_MFP7
3V3_MFP8: U1.27(SCL1/MFP8) ; port 3V3_MFP8
3V3_nERRB: U1.14(MFP5) ; port 3V3_nERRB
3V3_nPWDN: U1.11(PWDNB) ; port 3V3_nPWDN
3V3_SNS_I2C_SCL: U2.4(SM_CLK) ; port 3V3_SNS_SCL
3V3_SNS_I2C_SDA: U2.5(SM_DATA) ; port 3V3_SNS_SDA
3V3_SNS_nALERT: R39.1 U2.1(SLOW/~{ALERT}) ; port 3V3_SNS_nALERT
CFG0: R15.1 R17.2 U1.4(CFG0)
CFG1: R20.1 R23.2 U1.25(CFG1/MFP6)
CSIA_CK_N: U1.40(CKAN) ; port CSIA_CK_N
CSIA_CK_P: U1.39(CKAP) ; port CSIA_CK_P
CSIA_D0_N: U1.32(DA0N) ; port CSIA_D0_N
CSIA_D0_P: U1.31(DA0P) ; port CSIA_D0_P
CSIA_D1_N: U1.36(DA1N) ; port CSIA_D1_N
CSIA_D1_P: U1.35(DA1P) ; port CSIA_D1_P
CSIA_D2_N: U1.38(DA2N) ; port CSIA_D2_N
CSIA_D2_P: U1.37(DA2P) ; port CSIA_D2_P
CSIA_D3_N: U1.42(DA3N) ; port CSIA_D3_N
CSIA_D3_P: U1.41(DA3P) ; port CSIA_D3_P
MAX96724_PoC_A_V_N: L1.1 R14.1 R32.1
MAX96724_PoC_A_V_P: C8.2 F3.2 R14.2 R31.1
MAX96724_PoC_B_V_N: L4.1 R19.1 R34.1
MAX96724_PoC_B_V_P: C12.2 F4.2 R19.2 R33.1
MAX96724_PoC_C_V_N: L7.1 R25.1 R36.1
MAX96724_PoC_C_V_P: C18.2 F5.2 R25.2 R35.1
MAX96724_PoC_D_V_N: L10.1 R28.1 R40.1
MAX96724_PoC_D_V_P: C22.2 F6.2 R28.2 R38.1
RF_A: C5.2 L3.2 ; port RF_A
RF_B: C9.2 L6.2 ; port RF_B
RF_C: C13.2 L9.2 ; port RF_C
RF_D: C19.2 L12.2 ; port RF_D
SIOA_N: C7.1 U1.22(SIOAN)
SIOA_P: C5.1 U1.23(SIOAP)
SIOB_N: C11.1 U1.19(SIOBN)
SIOB_P: C9.1 U1.18(SIOBP)
SIOC_N: C17.1 U1.9(SIOCN)
SIOC_P: C13.1 U1.10(SIOCP)
SIOD_N: C21.1 U1.6(SIODN)
SIOD_P: C19.1 U1.5(SIODP)
X25_N: C15.2 U1.16(X2) Y1.3
X25_P: C14.2 U1.15(X1/OSC) Y1.1
NetC6_1: C6.1 L1.2 L2.1 R16.2
NetC7_2: C7.2 R18.2
NetC10_1: C10.1 L4.2 L5.1 R21.2
NetC11_2: C11.2 R24.2
NetC16_1: C16.1 L7.2 L8.1 R26.2
NetC17_2: C17.2 R27.2
NetC20_1: C20.1 L10.2 L11.1 R29.2
NetC21_2: C21.2 R30.2
NetC23_1: C23.1 R32.2 U2.12(SENSE1-)
NetC23_2: C23.2 R31.2 U2.11(SENSE1+)
NetC24_1: C24.1 R34.2 U2.14(SENSE2-)
NetC24_2: C24.2 R33.2 U2.13(SENSE2+)
NetC25_1: C25.1 R36.2 U2.7(SENSE3-)
NetC25_2: C25.2 R35.2 U2.8(SENSE3+)
NetC28_2: C28.2 C29.2 C30.2 U1.8(CAP_VDD)
NetC31_2: C31.2 C32.2 C33.2 U1.20(CAP_VDD)
NetC36_1: C36.1 R40.2 U2.9(SENSE4-)
NetC36_2: C36.2 R38.2 U2.10(SENSE4+)
NetL2_2: L2.2 L3.1 R16.1
NetL5_2: L5.2 L6.1 R21.1
NetL8_2: L8.2 L9.1 R26.1
NetL11_2: L11.2 L12.1 R29.1
NetR22_2: R22.2 U1.17(XRES)
NetR37_1: R37.1 U2.16(~{PWRDN})
NetR41_1: R41.1 U2.6(ADDRSEL)

Not connected (* = marked no-connect by the designer): U1 33(CKCP)* 34(CKCN)* 43(NC/DB0P)* 44(NC/DB0N)* 45(NC/CKBP)* 46(NC/CKBN)* 47(NC/DB1P)* 48(NC/DB1N)* 49(NC/DB2P)* 50(NC/DB2N)* 51(NC/CKFP)* 52(NC/CKFN)* 53(NC/DB3P)* 54(NC/DB3N)*

### Layout directives
net class 50SINGLE: NetC7_2, NetC11_2, NetC17_2, NetC21_2, RF_A, RF_B, RF_C, RF_D
differential pair: MAX96724_PoC_A_V_N, MAX96724_PoC_A_V_P, MAX96724_PoC_B_V_N, MAX96724_PoC_B_V_P, MAX96724_PoC_C_V_N, MAX96724_PoC_C_V_P, MAX96724_PoC_D_V_N, MAX96724_PoC_D_V_P, X25_N, X25_P
net class PWR: MAX96724_PoC_A_V_N, MAX96724_PoC_A_V_P, MAX96724_PoC_B_V_N, MAX96724_PoC_B_V_P, MAX96724_PoC_C_V_N, MAX96724_PoC_C_V_P, MAX96724_PoC_D_V_N, MAX96724_PoC_D_V_P, NetC6_1, NetC10_1, NetC16_1, NetC20_1, NetC28_2, NetC31_2, NetL2_2, NetL5_2, NetL8_2, NetL11_2, PoC_VCC
differential pair; differential pair class 100DIFF: SIOA_N, SIOA_P, SIOB_N, SIOB_P, SIOC_N, SIOC_P, SIOD_N, SIOD_P
differential pair; differential pair class CSIA: CSIA_CK_N, CSIA_CK_P, CSIA_D0_N, CSIA_D0_P, CSIA_D1_N, CSIA_D1_P, CSIA_D2_N, CSIA_D2_P, CSIA_D3_N, CSIA_D3_P

### Notes on the sheet
- PoC SUPPLY
- COAX I/O
- GMSL AGGREGATOR
- PLACE COUPLING CAPS AS CLOSE AS POSSIBLE TO MAX96724
- COAX is ok as 50ohm single ended but remove ground plane from under the pads of passives connected to the GMSL trace
- R_sense a bit small here, but intentional. PAC1934 operates with 100mV max drop across R_sense, and R_sense currently sized for about half that. Expected max current 1A (fuse pops at 1A), and as per EQ 42 of PAC1934 DS, we should use max 100mOhm res for this current.
- CSI WIRING AS PER PAGE 23 OF MAX96724 DS
- I2C ADDR 0x4E FOR DES_0
- Table 7 and 8 of DS for CFG configs
- (near R22) nPWDN PU IN PARENT SCHEM
- MAX96724FGTN/V+ is option with dual CSI out
- GMSL2 3GB/s mode
- COAX +
- XRES --> 402 1% TO GND
  X1/X2 --> 30PF CAP --> 2*(CL-CSTRAY)
  SDA/SCL --> OK, EXTRA PULLUPS ADDED BUT INTERNAL ONES EXIST
  SDA1/SCL1 --> COULD CONVERT TO HSYNC/VSYNC FOR STATUS LEDS
  CFG1 --> GMSL2 3GB/s OVER COAX (TABLE 8 OF DS)
  CFG0 --> I2C ADDR (TABLE 7 OF DS)
  COMPONENT SUGGESTIONS IN TABLE 3 OF DS
  - DECOUPLING CAPS OK
- MAX96724 PIN CONFIGS
- POWER
- CURRENT SENSE IC
- Using 1V0 on VDD would bypass the internal regulator, therefore 1V2 used
- TABLE 5-1 OF DS LINKS RES VALUES TO SMBUS ADDRESS HERE
- (near C47) Extra 10uF bulk caps for 1V2, 1V8, and 3V3 rails
- https://ww1.microchip.com/downloads/aemDocuments/documents/OTH/ProductDocuments/UserGuides/50002673A.pdf
- Cable assembly --> 095-820-157-006
  Connector --> FM4-NZRP-PCB-1
- Using C-2L-500 Coilcraft (#3) circuit but replaced  1210POC-223
- UNLABELLED RESISTORS ARE 0402 JUMPERS
- Table 5 of gmsl2 hardware design guide from analog
- POWER OVER COAX DIRECTLY FROM BATT SHOULD BE FINE PROVIDED THERE'S ENOUGH FILTERING - CASS
- SCHEMATICS CHECKED - JAN 29 2026
  - CHIP PINOUT OK
  - MFP USAGE OK
  - PWR PWR OK
  - PoC CIRCUITRY OK
  - PAC1934 AS PER EVAL BOARD SO OK
  - CFG STRAPS OK
- (in symbol CMP-015-00011-4, part A) 1 of 2
- (in symbol CMP-015-00011-4, part B) 2 of 2; NC PINS ARE DISCONNECTED IN MAX96724R; BUT CONNECTED IN MAX96724/F

### Library data of the parts
C5 C7-C9 C11-C15 C17-C19 C21-C46 = CMP-001-00058-1: LARGE PADS, 0402 CAP, CHANGE COMMENT TO MATCH REAL P/N; Capacitor Type: Ceramic; Min Operating Temperature: -55°C; Mounting Technology: Surface Mount; Pins: 2; Case/Package: 0402; RoHS Compliant: Yes; Max Operating Temperature: 85°C
C6 C10 C16 C20 = CMP-2007-03222-3: Chip Multilayer Ceramic Capacitors for General Purpose, 0805, 22uF, X5R, 15%, 20%, 25V; Case/Package: 0805; Depth: 1.25mm; Resistor Type: Ceramic; Voltage Rating: 25V; Lead Free: Lead Free; Voltage Rating (DC): 25V; Case Code (Metric): 2012; Thickness: 0.057inch; REACH SVHC: No SVHC; Material: Ceramic; Tolerance: 20%; Length: 2mm; Capacitance: 22uF; Case Code (Imperial): 0805; Max Operating Temperature: 85°C; Termination: SMD/SMT; Weight: 0.000335oz; Dielectric: X5R; Packaging: Tape and Reel; Voltage: 25V; Package Quantity: 3000; Height: 1.25mm; Mount: Surface Mount; Width: 1.25mm; Min Operating Temperature: -55°C
C47-C49 = CMP-2000-06226-4: Multilayer Ceramic Capacitor 10uF 16V X5R 20% SMD 0603 T/R; Packaging: Tape and Reel; Construction: Flat; Height: 0.8mm; Max Operating Temperature: 85°C; Dielectric: X5R; Case Code (Metric): 1608; Voltage Rating (DC): 16V; Width: 0.031inch; Voltage Rating: 16V; Length: 0.063inch; RoHS Compliant: Yes; Halogen Free: Halogen Free; Case Code (Imperial): 0603; Capacitance: 10uF; Mount: Surface Mount; Thickness: 0.031inch; Tolerance: 20%; Min Operating Temperature: -55°C; Series: M; Termination: SMD/SMT; Case/Package: 0603; Package Quantity: 1
F3-F6 = CMP-08606-000067-1: PTC RESET FUSE 13.2V 500MA 1210; Approvals: cULus; Resistance: 900mR; Time to Trip: 0.1s; Max Current Rating: 100A; Trip Current: 1A; Max Power Dissipation: 600mW; Case Code (Metric): 3225; Min Operating Temperature: -40°C; Max Voltage Rating (DC): 13.2V; Hold Current: 500mA; Working Voltage: 13.2V; Termination: SMD/SMT; Case Code (Imperial): 1210; Current Rating: 100A; REACH SVHC: No SVHC; Width: 2.8mm; Lead Free: Lead Free; Length: 3.43mm; Voltage Rating (DC): 13.2V; Packaging: Tape and Reel; Terminal Material: Copper; Voltage Rating: 13.2V; Height: 0.85mm; Case/Package: 1210; Package Quantity: 4000; Max Operating Temperature: 85°C; Power Dissipation: 600mW; Operating Supply Voltage: 13.2V
L1 L4 L7 L10 = CMP-2000-07143-1: Semi-Shielded Power Inductor, 100 uH, -40 to 125 degC, 2-Pin SMD, RoHS, Tape and Reel; Manufacturer: Bourns; Tolerance: ±20 / %; Brand/Series: SRN8040Series; Current, Rating: 1 / A; Inductance: 100 / µH; Manufacturer URL: http://www.bourns.com/; Package Description: 2-Pin Surface Mount Device, Body 8 x 8 mm; Datasheet URL: http://www.produktinfo.conrad.com/datenblaetter/1000000-1099999/001056456-da-01-en-MAG_ABG_LEIST_IND_SRN8040_101M_100UH_SMD.pdf; Datasheet Version: 08/2013; Termination: SMT; Type: Power; Mounting Technology: SurfaceMount; Package Reference: SRN8040-101M
L2 L5 L8 L11 = CMP-11268-000041-1: NOT COILCRAFT - ACTUAL P# --> ADL32VHC-220M / - Power Injection Chokes for PoC; Manufacturer Part Number: 1210POC-223MRC; Value: 22uH; Core Material: Ferrite; Saturation Current: 720mA; Series Resistance: 0.88Ω; Rms Current: 700mA; Automotive Grade: Grade 1; Self Resonant Frequency: 70MHz; Test Frequency: 100kHz; Tolerance: 20%; Ambient Temperature Range High: +125°C; Manufacturer: coilcraft; Octopart: https://octopart.com/1210poc-223mrc-coilcraft-103207315; Category: Ind; Device Class L2: Inductors; RoHS: TRUE; Device Class L3: Fixed Inductors; Package: 1210POC; Ambient Temperature Range Low: -40°C; ComponentLink2URL: https://drive.google.com/open?id=15FlOq8Y4YbRFohfA_cJ40jgnqs8va2Mh; Lead Free: Yes; Inductance: 22uH; Device Class L1: Passive Components; ComponentLink2Description: Datasheet; Automotive: Yes; Height: 3mm
L3 L6 L9 L12 = CMP-11268-000007-1: Fixed Inductors PFL1609 Low Profile 0.56 uH 20 % 1.4 A; Manufacturer: coilcraft; Rms Current: 1100mA; Self Resonant Frequency: 600MHz; Core Material: Composite; Tolerance: 20%; Value: 0.56uH; Automotive Grade: Grade 1; Saturation Current: 710mA; Test Frequency: 7.9MHz; Shielding: true; Series Resistance: 130mΩ; Lead Free: Yes; Device Class L1: Passive Components; Package: PFL1609; Octopart: https://octopart.com/pfl1609-561mew-coilcraft-20329171; ComponentLink2URL: https://www.coilcraft.com/pdfs/pfl1609.pdf; Manufacturer Part Number: PFL1609-561MEW; Ambient Temperature Range Low: -40°C; Composition: Wirewound; Inductance: 0.56uH; Device Class L2: Inductors; Category: Ind; Device Class L3: Fixed Inductors; Mouser Description: Fixed Inductors PFL1609 Low Profile 0.56 uH 20 % 1.4 A; Automotive: Yes; ComponentLink2Description: Datasheet; Ambient Temperature Range High: +105°C; Height: 0.95mm; RoHS: TRUE
R14 R19 R25 R28 = CMP-009-00002-14: Value: 100k
R15-R18 R20-R24 R26 R27 R29-R40 = CMP-009-00002-14: Resistor
  R31-R36 R38 R40: Value: 0
  R37 R39: Value: 100k
R41 = CMP-009-00002-14: Resistor; Value: 100k
U1 = CMP-015-00011-4: Quad Tunneling GMSL2/1 to CSI-2 Deserializer
U2 = CMP-06317-000025-1: QUAD HIGH-SIDE CURRENT SENSOR; Accuracy: 1%; Min Operating Temperature: -40°C; Mount: Surface Mount; Max Operating Temperature: 85°C; Packaging: Cut Tape; RoHS Compliant: No
Y1 = CMP-2000-05733-3: Crystal 25MHz ±20ppm (Tol) ±30ppm (Stability) 18pF FUND 60Ω 4-Pin SMD T/R; Series Resistance: 60R; Length: 3.2mm; Depth: 2.5mm; Packaging: Tape and Reel; Min Operating Temperature: -40°C; Operating Frequency: 25 MHz; Lead Free: Lead Free; Number of Pins: 4; Frequency Tolerance: 20ppm; Radiation Hardening: No; Max Operating Temperature: 85°C; Termination: SMD/SMT; Frequency Stability: 30ppm; Frequency: 25MHz; Series: ABM8G; Mount: Surface Mount; Package Quantity: 1000; Height: 0.039inch; Width: 0.098inch; Case/Package: CSMD; ESR (Equivalent Series Resistance): 60R; Load Capacitance: 18pF; Tolerance: 20ppm

## Sheet 3V3_REG.SchDoc
size A; SheetNumber: 3; SheetTotal: 4
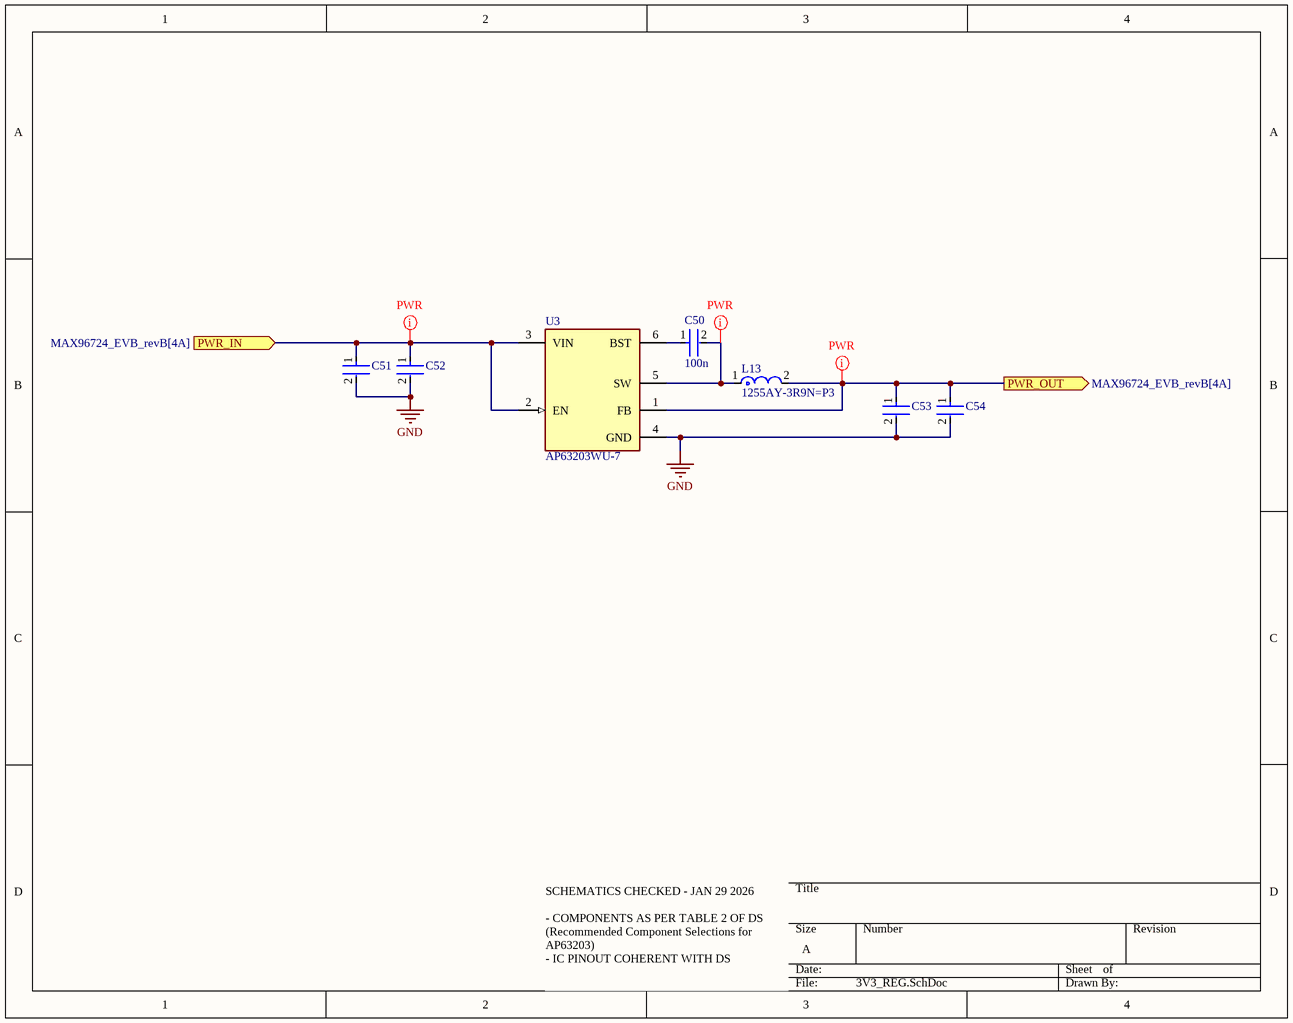
[diagram p8: 3V3_REG.SchDoc]

### Parts
C50  100n  [FP-0402-L_1_0_0_05-W_0_5-IPC_A]
C51  12103D106KAT2A  [FP-1210-L_3_3_0_4-W_2_5_0-MFG]  (value not drawn)
C52  DNP  [FP-1210-L_3_3_0_4-W_2_5_0-MFG]  (value not drawn)
C53  GRM21BR61E226ME44L  [FP-GRM21B-0_2-e0_2_0_7-IPC_B]  (value not drawn)
C54  GRM21BR61E226ME44L  [FP-GRM21B-0_2-e0_2_0_7-IPC_B]  (value not drawn)
L13  1255AY-3R9N=P3  [FP-DG6045C-MFG]
U3  AP63203WU-7  [FP-TSOT26-MFG]

### Ports
PWR_IN (in, see MAX96724_EVB_revB[4A]), PWR_OUT (out, see MAX96724_EVB_revB[4A])

### Nets
3V3: C53.1 C54.1 L13.2 U3.1(FB) ; port PWR_OUT
GND: C51.2 C52.2 C53.2 C54.2 U3.4(GND)
LO_VCC: C51.1 C52.1 U3.2(EN) U3.3(VIN) ; port PWR_IN
NetC50_1: C50.1 U3.6(BST)
NetC50_2: C50.2 L13.1 U3.5(SW)

### Layout directives
net class PWR: 3V3, LO_VCC, NetC50_2

### Notes on the sheet
- SCHEMATICS CHECKED - JAN 29 2026
  - COMPONENTS AS PER TABLE 2 OF DS (Recommended Component Selections for AP63203)
  - IC PINOUT COHERENT WITH DS

### Library data of the parts
C50 = CMP-001-00058-1: as C5 on sheet MAX96724_PINOUT; Min Operating Temperature: -55°C; Mounting Technology: Surface Mount; Pins: 2; Case/Package: 0402; RoHS Compliant: Yes; Max Operating Temperature: 85°C
C51 C52 = CMP-2000-05477-2: General Purpose Ceramic Capacitor, 1210, 10uF, 10%, X5R, 15%, 25V; Lead Free: Lead Free; Max Operating Temperature: 85°C; REACH SVHC: No SVHC; Depth: 2.5mm; Packaging: Tape and Reel; Min Operating Temperature: -55°C; Height: 2.29mm; Construction: Flat; Case Code (Imperial): 1210; Radiation Hardening: No; Voltage: 25V; Case/Package: 1210; Series: -; Dielectric: X5R; Length: 3.2mm; Thickness: 0.11inch; Package Quantity: 1; Termination: SMD/SMT; Case Code (Metric): 3225; Voltage Rating (DC): 25V; Voltage Rating: 25V; Contact Plating: Tin; RoHS Compliant: Yes; Mount: Surface Mount; Width: 0.098inch; Capacitance: 10uF; Tolerance: 10%
C53 C54 = CMP-2007-03222-3: as C6 on sheet MAX96724_PINOUT; Case/Package: 0805; Depth: 1.25mm; Resistor Type: Ceramic; Voltage Rating: 25V; Lead Free: Lead Free; Voltage Rating (DC): 25V; Case Code (Metric): 2012; Thickness: 0.057inch; REACH SVHC: No SVHC; Material: Ceramic; Tolerance: 20%; Length: 2mm; Capacitance: 22uF; Case Code (Imperial): 0805; Max Operating Temperature: 85°C; Termination: SMD/SMT; Weight: 0.000335oz; Dielectric: X5R; Packaging: Tape and Reel; Voltage: 25V; Package Quantity: 3000; Height: 1.25mm; Mount: Surface Mount; Width: 1.25mm; Min Operating Temperature: -55°C
L13 = CMP-06042-002684-1: Shielded Wirewound Inductor 3.9uH 30% 4200mA 0.0264Ω SMD; Saturation Current: 4.7A; Test Frequency: 100kHz; Core Material: Ferrite; Current Rating: 4.2A; DC Resistance (DCR): 26.4mR; Inductance: 3.9uH; Resistor Type: Wirewound; Width: 0.248inch; Mount: Surface Mount; Tolerance: 30%; Packaging: Tape and Reel; Max Operating Temperature: 85°C; Shielding: Shielded; Length: 0.248inch; Min Operating Temperature: -40°C; Height - Seated (Max): 0.177inch; Case/Package: Nonstandard
U3 = CMP-12757-000006-1: IC REG BUCK 3.3V 2A TSOT26; Manufacturer: Diodes Inc.; Output Type: Fixed; Min Supply Voltage: 3.8V; Number Of Outputs: 1; Max Junction Temp: +160°C; Nominal Supply Current: 22uA; Standoff Height: 0.01mm; Switching Frequency: 1.1MHz; Max Supply Voltage: 32V; ComponentLink2Description: Datasheet; Device Class L1: Integrated Circuits (ICs); Temperature: to +160°C; Device Class L3: Voltage Regulators - Switching; RoHS: TRUE; Octopart: https://octopart.com/ap63203wu-7-diodes+inc.-98099550; Output Voltage: 3.3V; Lead Free: Yes; ComponentLink2URL: https://www.diodes.com/assets/Datasheets/AP63200-AP63201-AP63203-AP63205.pdf; Digikey Description: IC REG BUCK 3.3V 2A TSOT26; Footprint Url: https://www.diodes.com/assets/Package-Files/TSOT26.pdf; Ambient Temperature Range High: +85°C; Height: 1mm; Automotive: No; Temperature Range High: +160°C; Switching Topology: Buck; Output Current: 2A; Package: TSOT26; Category: IC; Mouser Description: AP63203 Series 3.3 V 2 A SMT Fixed Low IQ Synchronous Buck - TSOT-26; Device Class L2: Power Management ICs; Ambient Temperature Range Low: -40°C; Manufacturer Part Number: AP63203WU-7

## Sheet ADJ_REG.SchDoc
size A; SheetNumber: 4; SheetTotal: 4
Used 2 times, as channels REG_1, REG_2. Parts and nets are listed once, with the designators drawn on the sheet.
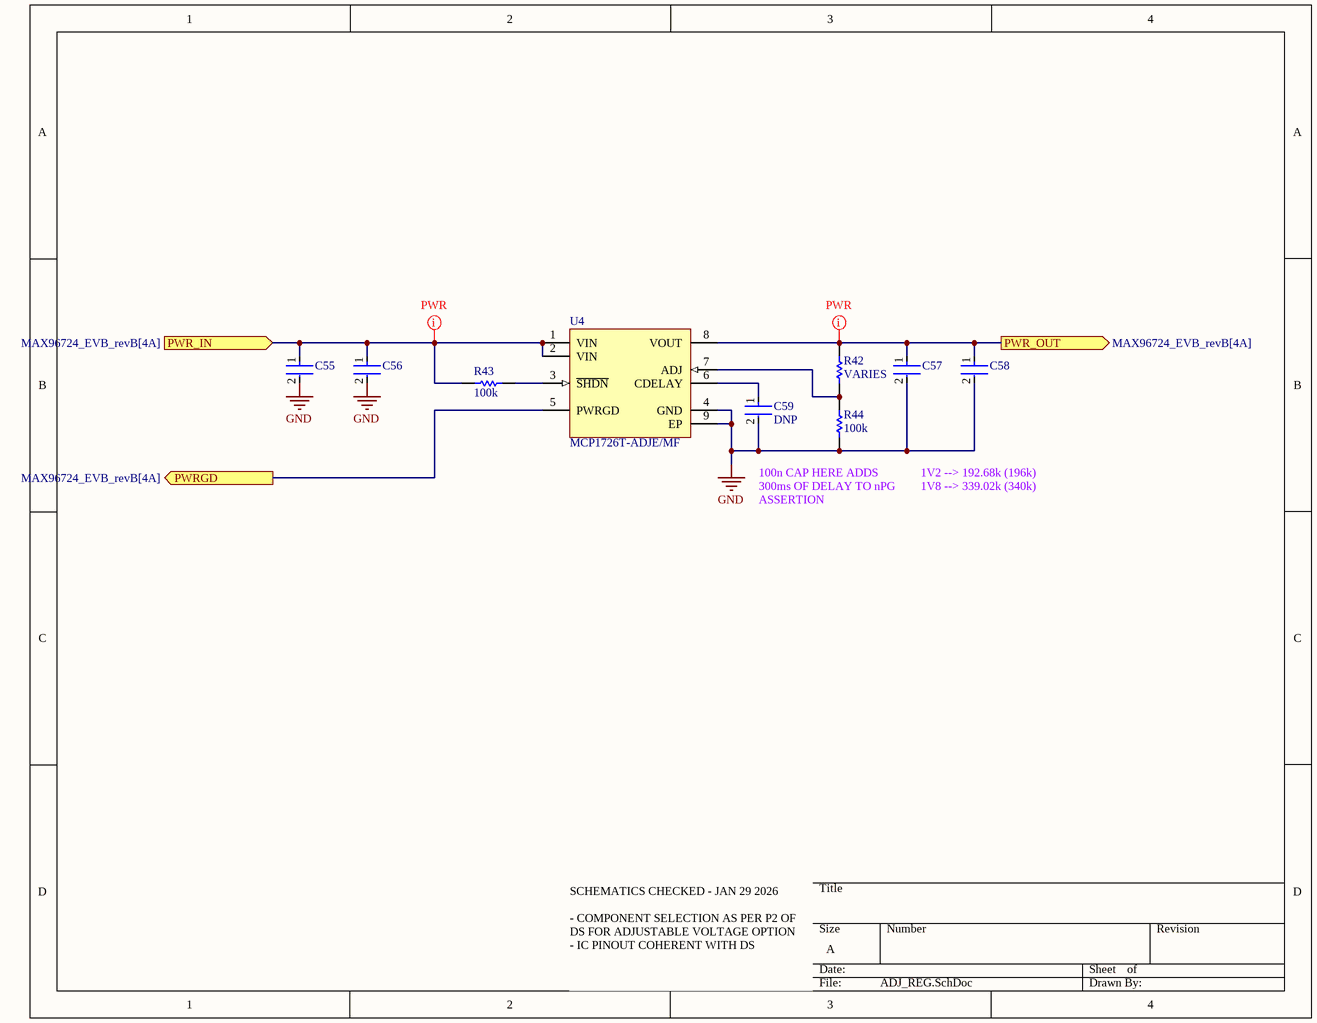
[diagram p9: ADJ_REG.SchDoc]

### Parts
C55  C0805C475J4RACAUTO  [FP-C0805C475J4RACAUTO-MFG]  (value not drawn)
C56  DNP  [FP-C0805C475J4RACAUTO-MFG]  (value not drawn)
C57  HMK325B7105KN-T  [FP-1210-L_3_2_0_3-W_2_5_0-IPC_B]  (value not drawn)
C58  DNP  [FP-1210-L_3_2_0_3-W_2_5_0-IPC_B]  (value not drawn)
C59  DNP  [FP-0402-L_1_0_0_05-W_0_5-IPC_A]
R42  VARIES  [R0603B]
R43  100k  [R0603B]
R44  100k  [R0603B]
U4  MCP1726T-ADJE/MF  [DFN-MF8]

### Ports
PWR_IN (in, see MAX96724_EVB_revB[4A]), PWR_OUT (out, see MAX96724_EVB_revB[4A]), PWRGD (out, see MAX96724_EVB_revB[4A])

### Nets
GND: C55.2 C56.2 C57.2 C58.2 C59.2 R44.1 U4.4(GND) U4.9(EP)
PWR_IN: C55.1 C56.1 R43.1 U4.1(VIN) U4.2(VIN) ; port PWR_IN
PWR_OUT: C57.1 C58.1 R42.2 U4.8(VOUT) ; port PWR_OUT
PWRGD: U4.5(PWRGD) ; port PWRGD
NetC59_1: C59.1 U4.6(CDELAY)
NetR42_1: R42.1 R44.2 U4.7(ADJ)
NetR43_2: R43.2 U4.3(~{SHDN})

### Channels
REG_1: designators end in _REG_1; ports PWR_IN=3V3 PWR_OUT=1V8 PWRGD=NetU4_REG_1_5
REG_2: designators end in _REG_2; ports PWR_IN=3V3 PWR_OUT=1V2 PWRGD=NetU4_REG_2_5

### Layout directives
net class PWR: 1V8, 3V3

### Notes on the sheet
- (near R44) 100n CAP HERE ADDS 300ms OF DELAY TO nPG ASSERTION
- 1V2 --> 192.68k (196k)
  1V8 --> 339.02k (340k)
- SCHEMATICS CHECKED - JAN 29 2026
  - COMPONENT SELECTION AS PER P2 OF DS FOR ADJUSTABLE VOLTAGE OPTION
  - IC PINOUT COHERENT WITH DS

### Library data of the parts
C55 C56 = CMP-00212-84766729-1: C0805C475J4RACAUTO Cap Ceramic 4.7uF 16V X7R 5% Pad SMD 0805 125C Automotive T/R; Capacitance: 4.7µF; Max Operating Temperature: 125°C; Dielectric Material: Ceramic; Voltage Rating (DC): 16V; Dielectric: X7R; Height: 1.4mm; Case/Package: 0805; NexarPartId: 84766729; Voltage Rating: 16V; RoHS: Compliant; Material: Ceramic; Packaging: Cut Tape; Tolerance: 5%; Min Operating Temperature: -55°C
C57 C58 = CMP-14477-002774-2: None; Dielectric: X5R; Capacitance: 1uF; Voltage Rating (DC): 100V; Tolerance: 10%; Length: 3.2mm; Thickness: 0.083inch; Construction: Flat; Width: 2.5mm; Number of Pins: 2; Height: 1.9mm; REACH SVHC: No SVHC; Case Code (Metric): 3225; Termination: SMD/SMT; Packaging: Tape and Reel; Resistor Type: Ceramic; Mount: Surface Mount; Radiation Hardening: No; Case/Package: 1210; Case Code (Imperial): 1210; Min Operating Temperature: -55°C; Max Operating Temperature: 125°C; Halogen Free: Halogen Free; Voltage Rating: 100V; Depth: 2.5mm; Package Quantity: 1; RoHS Compliant: Yes; Voltage: 100V; Series: M
C59 = CMP-001-00058-1: as C5 on sheet MAX96724_PINOUT; Min Operating Temperature: -55°C; Mounting Technology: Surface Mount; Pins: 2; Case/Package: 0402; RoHS Compliant: Yes; Max Operating Temperature: 85°C
R42 R43 = CMP-009-00002-14: Resistor
  R42: Value: VARIES
  R43: Value: 100k
R44 = CMP-009-00002-14: Resistor; Value: 10k
U4 = CMP-0136-00358-1: 1A, Low Voltage, Low Quiescent Current LDO Regulator, 8-Pin DFN, Extended Temperature, Tape and Reel; DatasheetVersion: revC, Aug-2007; PackageDescription: 8-Lead Plastic Dual Flat, No Lead Package (MF) - 3x3x0.9mm Body [DFN]; PackageVersion: revBB, Aug-2009; PackageReference: DFN-MF8

## Nets that join several sheets
1V2: MAX96724_EVB_revB (J7.1), MAX96724_PINOUT (10 pins), REG_2 (C57_REG_2.1 C58_REG_2.1 R42_REG_2.2 U4_REG_2.8)
1V8: MAX96724_EVB_revB (J5.1), MAX96724_PINOUT (7 pins), REG_1 (C57_REG_1.1 C58_REG_1.1 R42_REG_1.2 U4_REG_1.8)
3V3: MAX96724_EVB_revB (9 pins), MAX96724_PINOUT (12 pins), 3V3_REG (C53.1 C54.1 L13.2 U3.1), REG_1 (5 pins), REG_2 (5 pins)
GND: MAX96724_EVB_revB (59 pins), MAX96724_PINOUT (46 pins), 3V3_REG (5 pins), REG_1 (8 pins), REG_2 (8 pins)
LO_VCC: MAX96724_EVB_revB (6 pins), 3V3_REG (C51.1 C52.1 U3.2 U3.3)
PoC_VCC: MAX96724_EVB_revB (6 pins), MAX96724_PINOUT (F3.1 F4.1 F5.1 F6.1)
3V3_CAM_I2C_SCL: MAX96724_EVB_revB (J14.1 P5.2 R5.1), MAX96724_PINOUT (U1.29)
3V3_CAM_I2C_SDA: MAX96724_EVB_revB (J13.1 P4.2 R4.1), MAX96724_PINOUT (U1.28)
3V3_LOCK: MAX96724_EVB_revB (J11.3 R12.2), MAX96724_PINOUT (U1.13)
3V3_MFP0: MAX96724_EVB_revB (J11.4), MAX96724_PINOUT (U1.1)
3V3_MFP1: MAX96724_EVB_revB (J11.5), MAX96724_PINOUT (U1.2)
3V3_MFP2: MAX96724_EVB_revB (J11.6), MAX96724_PINOUT (U1.3)
3V3_MFP3: MAX96724_EVB_revB (J11.7), MAX96724_PINOUT (U1.12)
3V3_MFP7: MAX96724_EVB_revB (J11.8), MAX96724_PINOUT (U1.26)
3V3_MFP8: MAX96724_EVB_revB (J11.9), MAX96724_PINOUT (U1.27)
3V3_nERRB: MAX96724_EVB_revB (J11.2 R10.1), MAX96724_PINOUT (U1.14)
3V3_nPWDN: MAX96724_EVB_revB (J11.1 P2.1 R3.1), MAX96724_PINOUT (U1.11)
3V3_SNS_I2C_SCL: MAX96724_EVB_revB (J16.1 P8.2 R7.1), MAX96724_PINOUT (U2.4)
3V3_SNS_I2C_SDA: MAX96724_EVB_revB (J15.1 P7.2 R6.1), MAX96724_PINOUT (U2.5)
CSIA_CK_N: MAX96724_EVB_revB (J9.15), MAX96724_PINOUT (U1.40)
CSIA_CK_P: MAX96724_EVB_revB (J9.14), MAX96724_PINOUT (U1.39)
CSIA_D0_N: MAX96724_EVB_revB (J9.21), MAX96724_PINOUT (U1.32)
CSIA_D0_P: MAX96724_EVB_revB (J9.20), MAX96724_PINOUT (U1.31)
CSIA_D1_N: MAX96724_EVB_revB (J9.18), MAX96724_PINOUT (U1.36)
CSIA_D1_P: MAX96724_EVB_revB (J9.17), MAX96724_PINOUT (U1.35)
CSIA_D2_N: MAX96724_EVB_revB (J9.12), MAX96724_PINOUT (U1.38)
CSIA_D2_P: MAX96724_EVB_revB (J9.11), MAX96724_PINOUT (U1.37)
CSIA_D3_N: MAX96724_EVB_revB (J9.9), MAX96724_PINOUT (U1.42)
CSIA_D3_P: MAX96724_EVB_revB (J9.8), MAX96724_PINOUT (U1.41)
RF_A: MAX96724_EVB_revB (J10.2), MAX96724_PINOUT (C5.2 L3.2)
RF_B: MAX96724_EVB_revB (J10.1), MAX96724_PINOUT (C9.2 L6.2)
RF_C: MAX96724_EVB_revB (J10.4), MAX96724_PINOUT (C13.2 L9.2)
RF_D: MAX96724_EVB_revB (J10.3), MAX96724_PINOUT (C19.2 L12.2)